# EAGLE design Quad_Board (EAGLE 7.5.0)
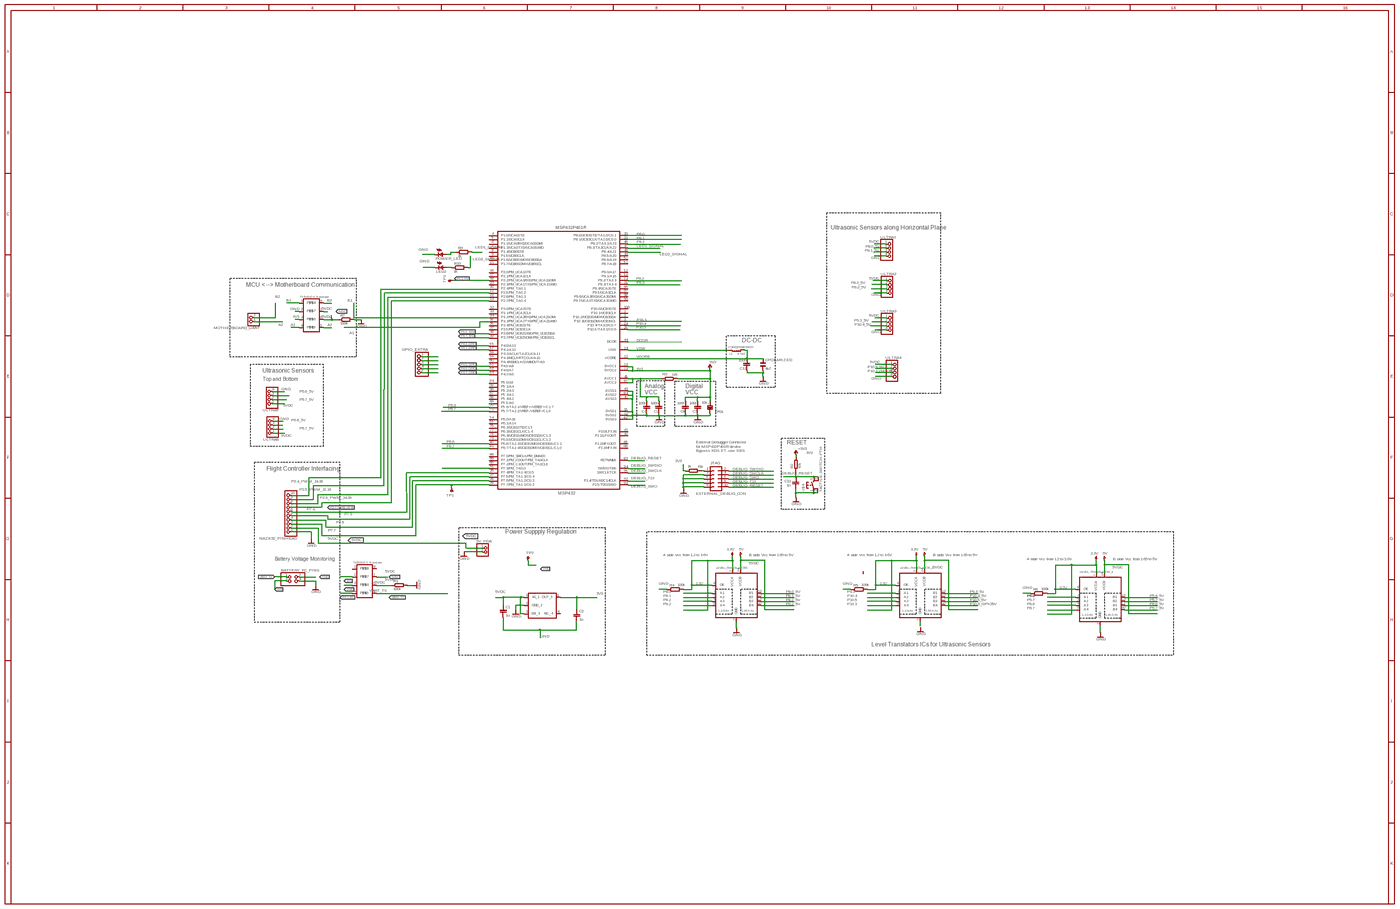
[diagram p0: schematic, sheet 1, overview]
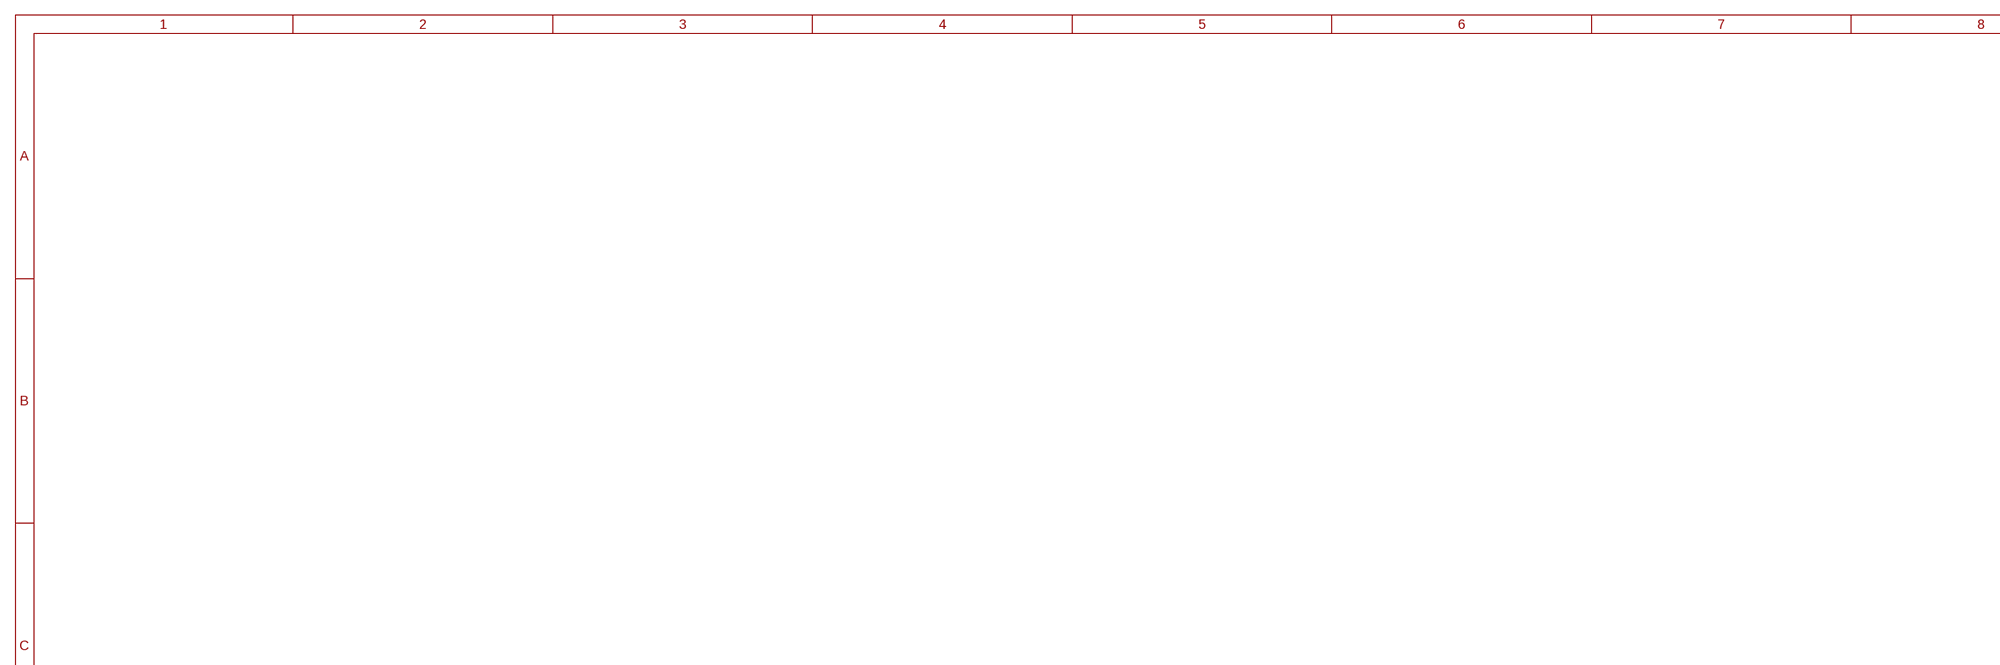
[diagram p1: schematic, sheet 1, part 1 of 4]
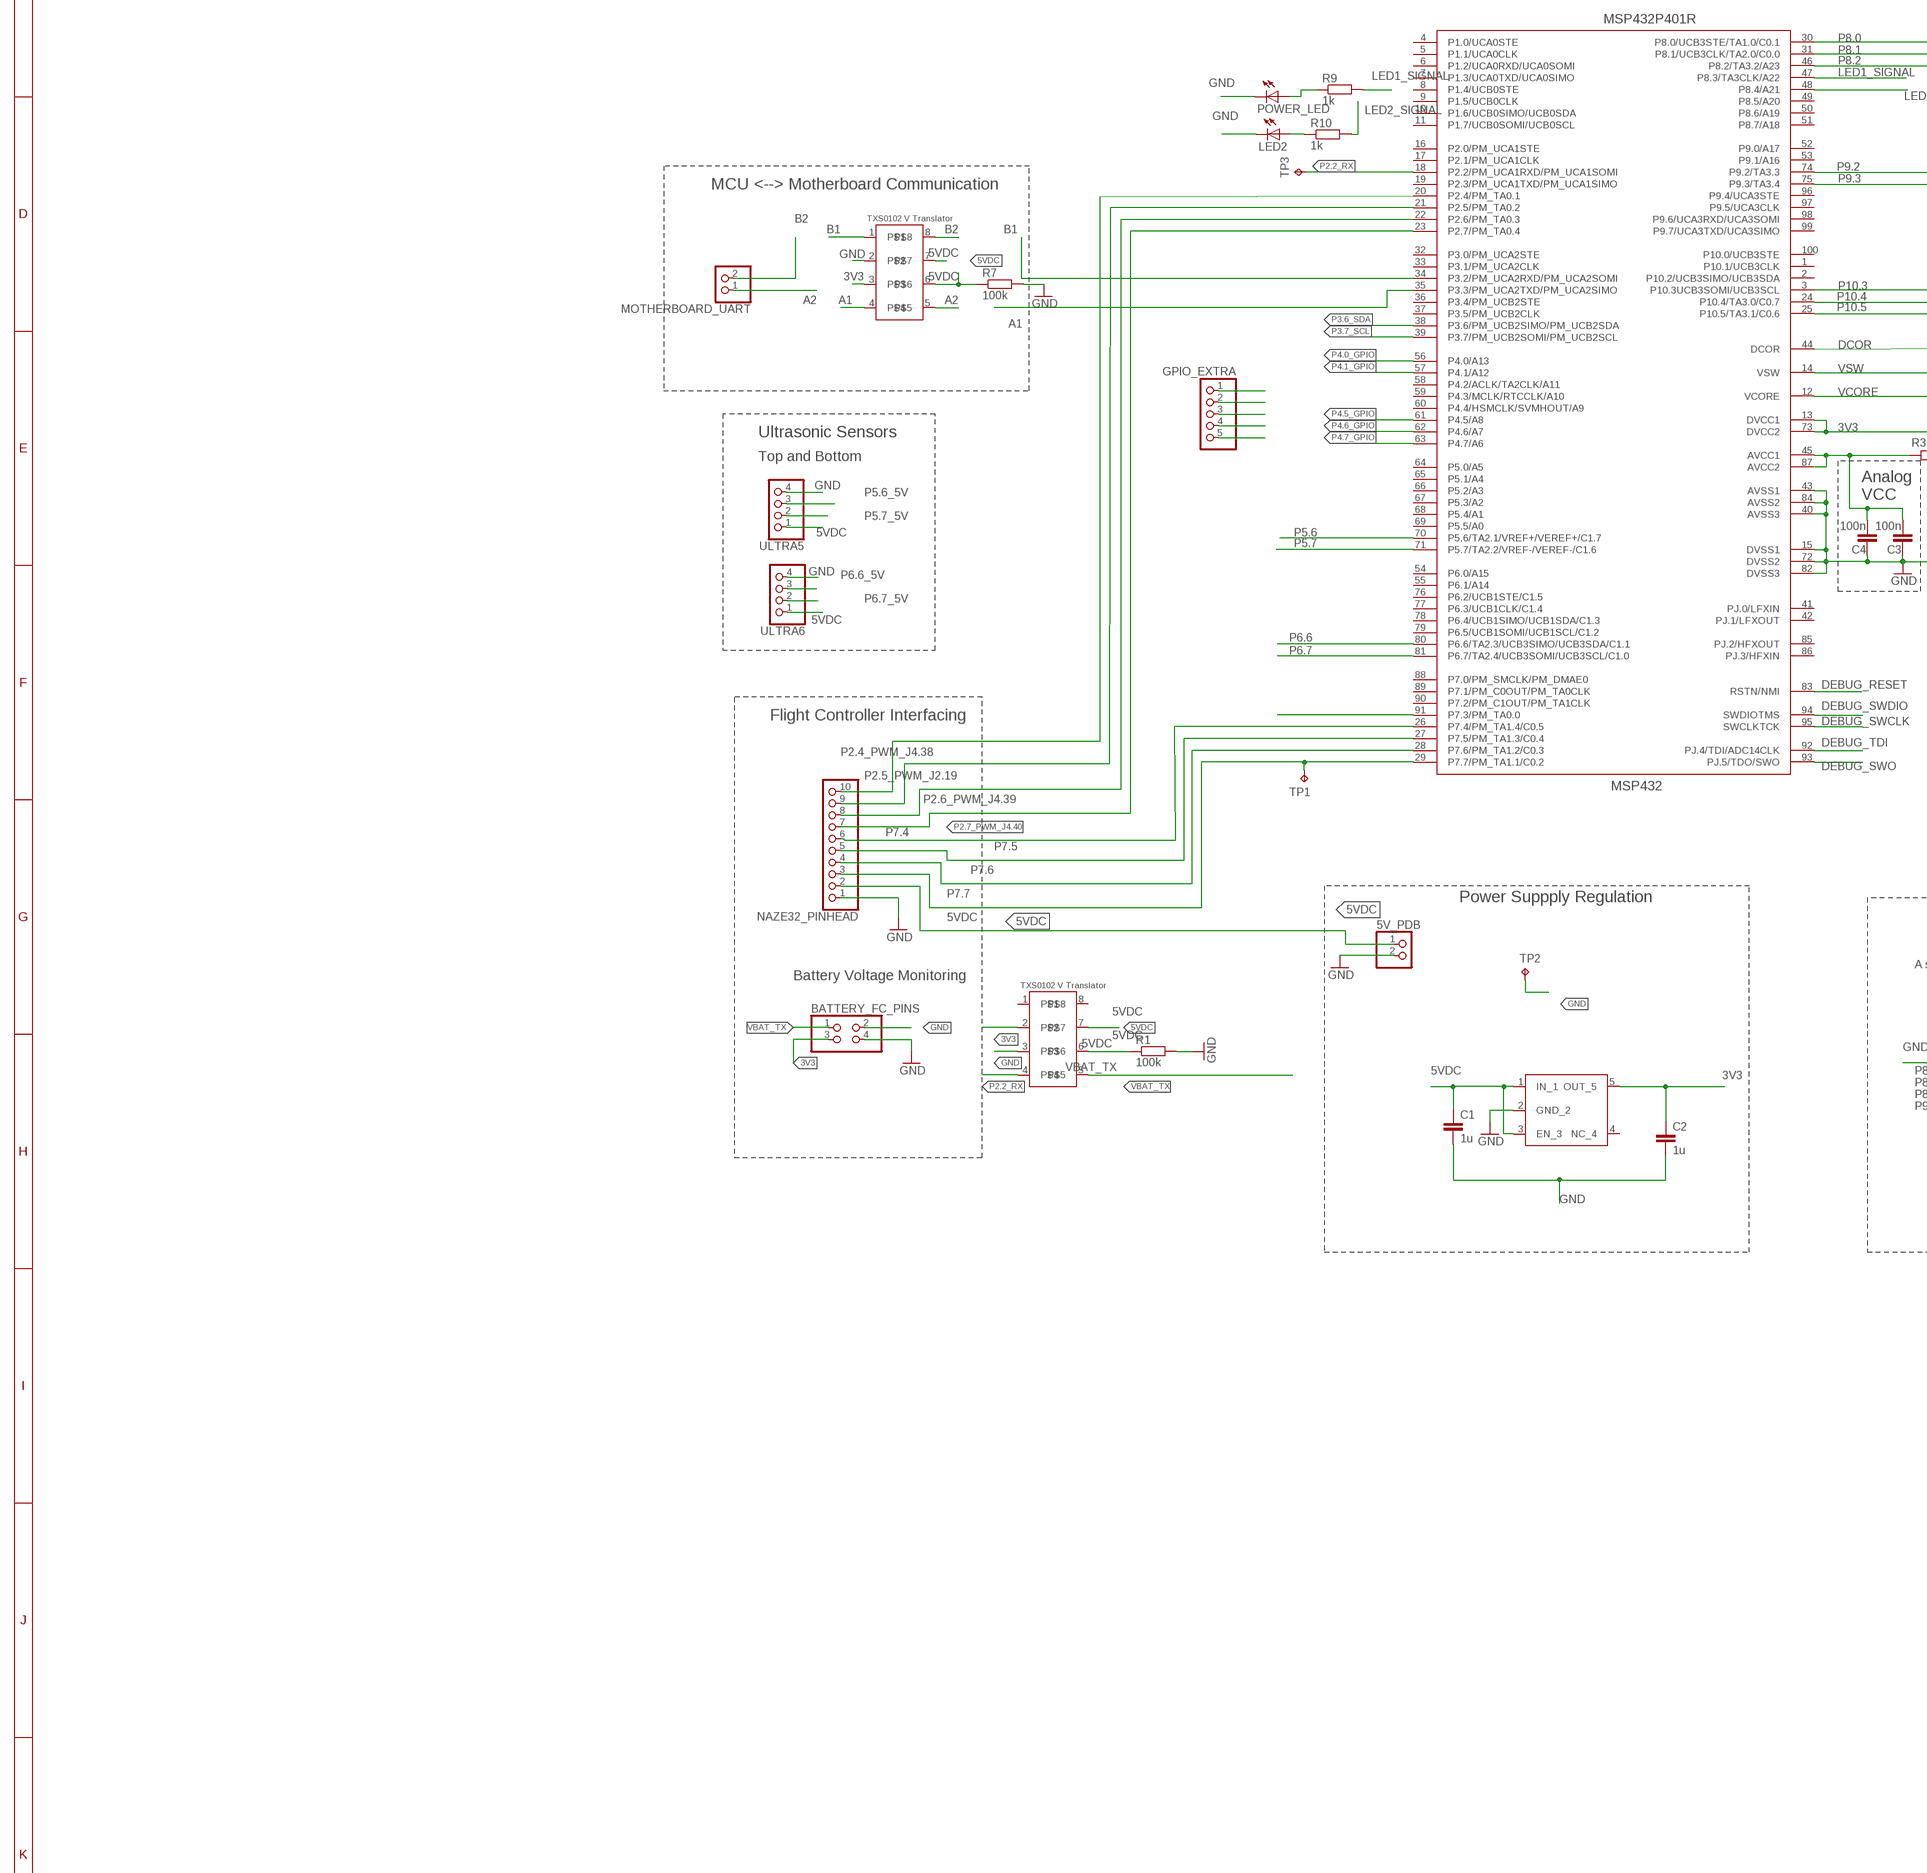
[diagram p2: schematic, sheet 1, part 2 of 4]
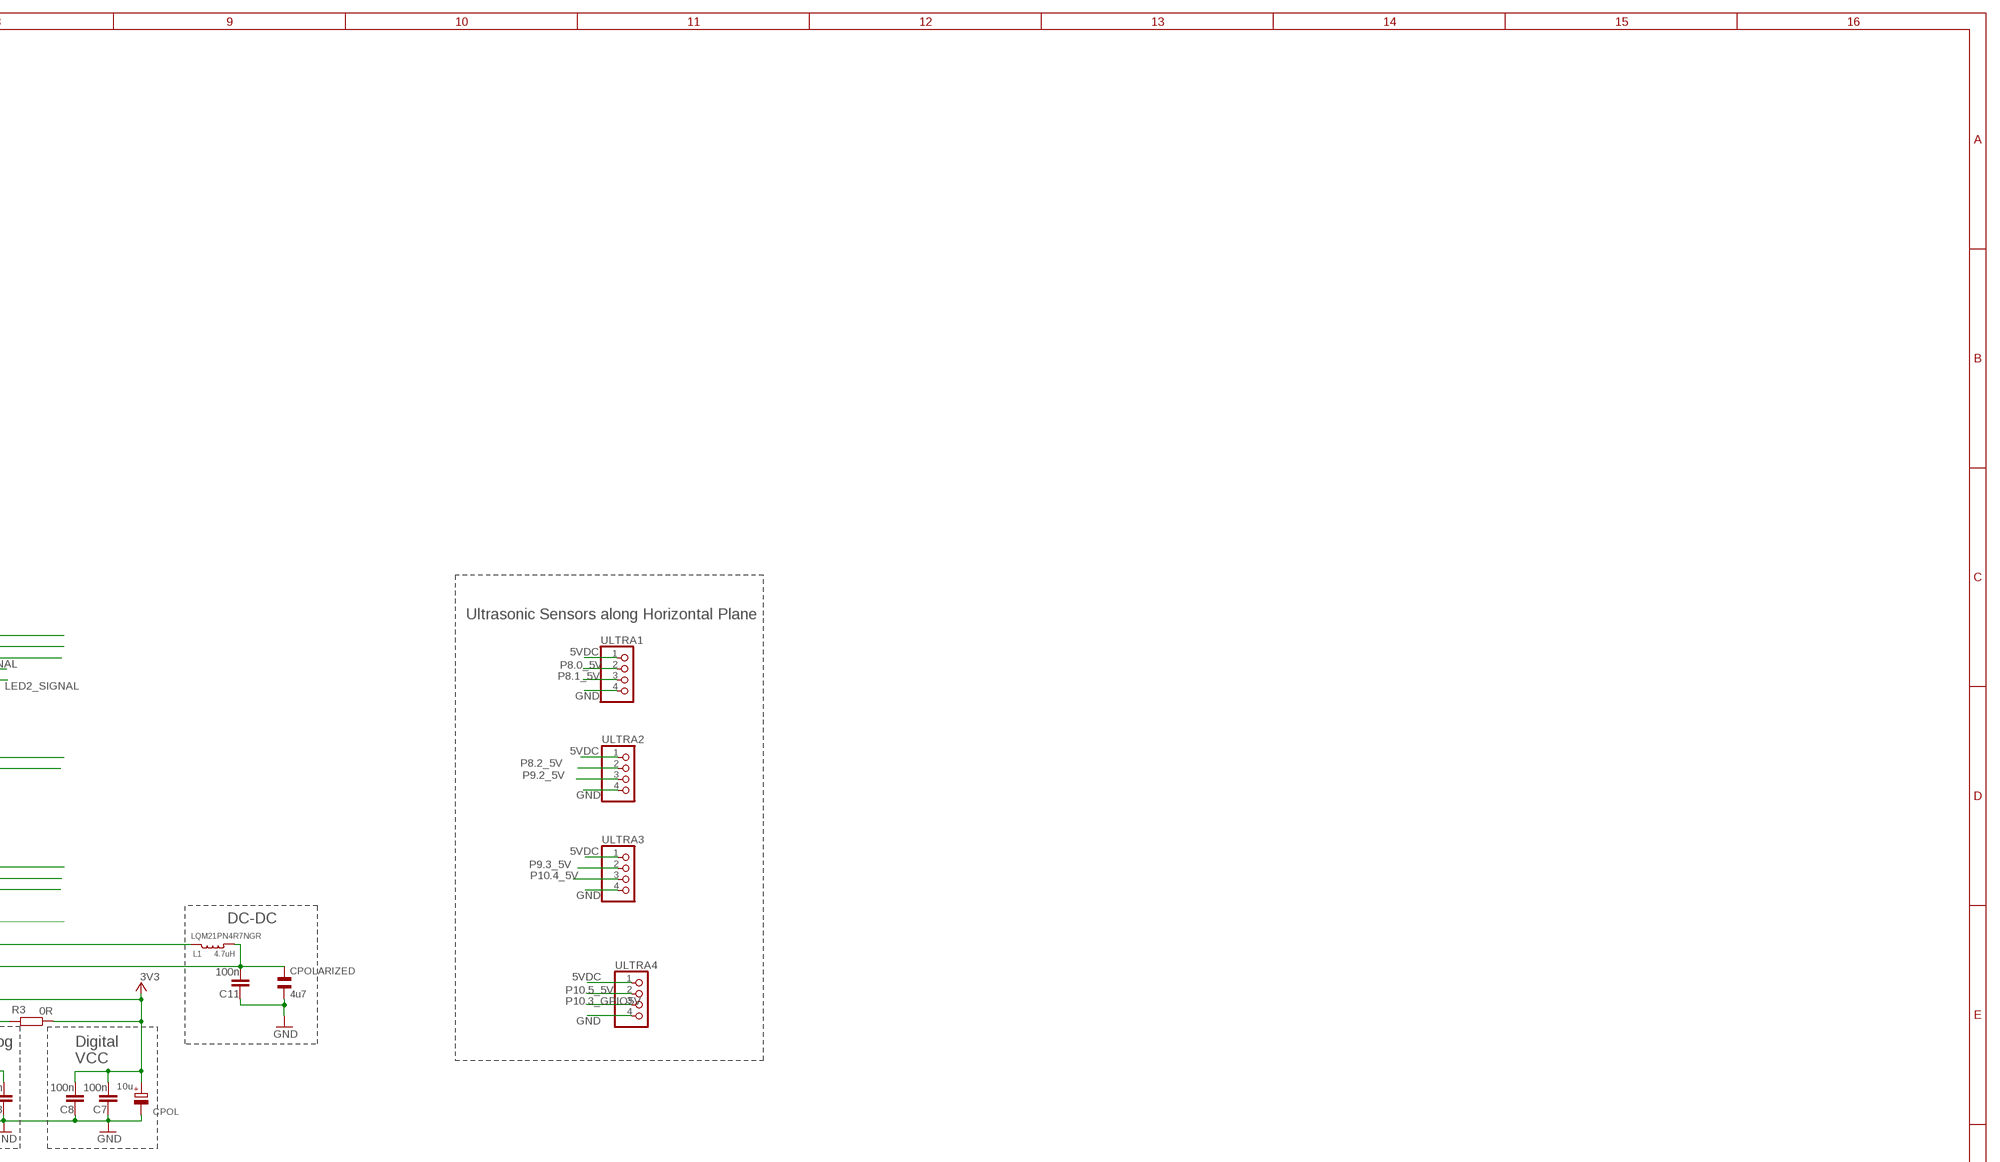
[diagram p3: schematic, sheet 1, part 3 of 4]
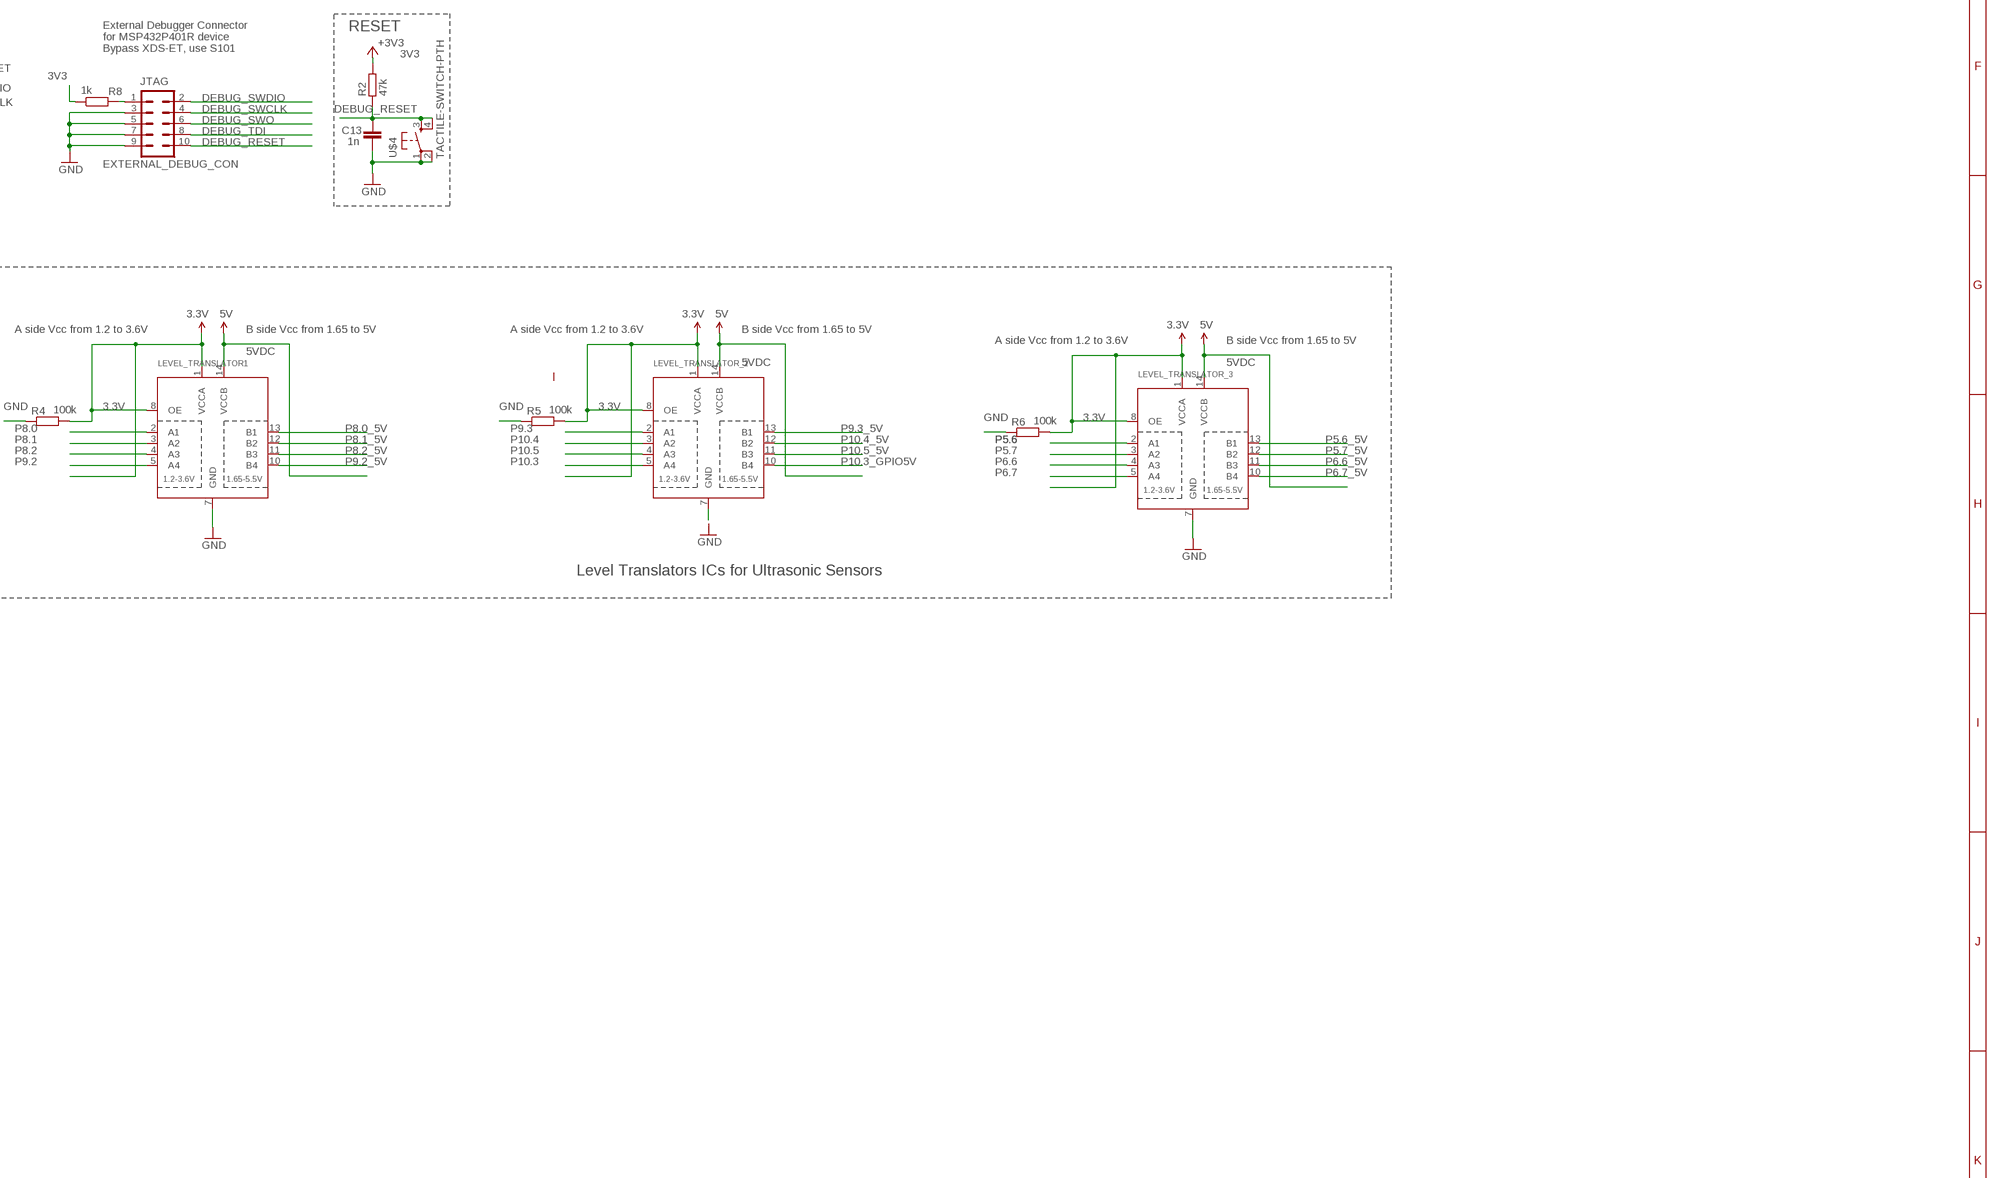
[diagram p4: schematic, sheet 1, part 4 of 4]

## Parts
5V_PDB  PINHD-1X2  [1X02]
BATTERY_FC_PINS  PINHD-2X2  [2X02]
C1  1u  C-EUC0805  [C0805]
C2  1u  C-EUC0805  [C0805]
C3  100n  C-EUC0805  [C0805]
C4  100n  C-EUC0805  [C0805]
C7  100n  C-EUC0805  [C0805]
C8  100n  C-EUC0805  [C0805]
C11  100n  C-EUC0805  [C0805]
C13  1n  C-EUC0805  [C0805]
CPOL  10u  CPOL-EUA/3216-18R  [A/3216-18R]
CPOLARIZED  4u7  CSMD0805  [CSMD0805]
GPIO_EXTRA  PINHD-1X5  [1X05]
JTAG  EXTERNAL_DEBUG_CON  [EXTERNAL_DEBUG]
L1  4.7uH  LQM2MP_G0  [0806]
LED2  LED_E  [LED_1206]
LEVEL_TRANSLATOR1  TXB0104PWRSOIC14  [SO14]
LEVEL_TRANSLATOR_2  TXB0104PWRSOIC14  [SO14]
LEVEL_TRANSLATOR_3  TXB0104PWRSOIC14  [SO14]
MOTHERBOARD_UART  PINHD-1X2  [1X02]
MSP432P401R  MSP432  [PZ100]
NAZE32_PINHEAD  PINHD-1X10  [1X10]
POWER_LED  LED_E  [LED_1206]
R1  100k  R-EU_M1206  [M1206]
R2  47k  R-EU_R1206  [R1206]
R3  0R  R-EU_RM0402  [0402]
R4  100k  R-EU_M1206  [M1206]
R5  100k  R-EU_M1206  [M1206]
R6  100k  R-EU_M1206  [M1206]
R7  100k  R-EU_M1206  [M1206]
R8  1k  R-EU_R1206  [R1206]
R9  1k  R-EU_M0805  [M0805]
R10  1k  R-EU_M0805  [M0805]
TP1  TPB1,27  [B1,27]
TP2  TPB2,54  [B2,54]
TP3  TPB1,27  [B1,27]
U$1  TXS0102  [DCT_R-PDSO-G8]
U$2  TLV733P  [SOT23-5]
U$3  TXS0102  [DCT_R-PDSO-G8]
U$4  TACTILE-SWITCH-PTH  [TAC-SWITCH-PTH]
ULTRA1  PINHD-1X4  [1X04]
ULTRA2  PINHD-1X4  [1X04]
ULTRA3  PINHD-1X4  [1X04]
ULTRA4  PINHD-1X4  [1X04]
ULTRA5  PINHD-1X4  [1X04]
ULTRA6  PINHD-1X4  [1X04]

## Nets
3.3V: LEVEL_TRANSLATOR1.1(VCCA) LEVEL_TRANSLATOR1.8(OE) LEVEL_TRANSLATOR_2.1(VCCA) LEVEL_TRANSLATOR_2.8(OE) LEVEL_TRANSLATOR_3.1(VCCA) LEVEL_TRANSLATOR_3.8(OE) R4.2 R5.2 R6.2
3V3: BATTERY_FC_PINS.3 C2.1 C7.1 C8.1 CPOL.+ MSP432P401R.13(DVCC1) MSP432P401R.73(DVCC2) R2.2 R3.1 R8.1 U$1.3 U$2.5(OUT_5) U$3.2 ; supply symbol labelled +3V3
5VDC: 5V_PDB.1 C1.1 LEVEL_TRANSLATOR1.14(VCCB) LEVEL_TRANSLATOR_2.14(VCCB) LEVEL_TRANSLATOR_3.14(VCCB) NAZE32_PINHEAD.2 R1.1 R7.1 U$1.6 U$1.7 U$2.1(IN_1) U$2.3(EN_3) U$3.6 U$3.7 ULTRA1.1 ULTRA2.1 ULTRA3.1 ULTRA4.1 ULTRA5.1 ULTRA6.1 ; supply symbol labelled 5V
A1: MSP432P401R.35(P3.3/PM_UCA2TXD/PM_UCA2SIMO) U$1.4
A2: MOTHERBOARD_UART.1 U$1.5
B1: MSP432P401R.34(P3.2/PM_UCA2RXD/PM_UCA2SOMI) U$1.1
B2: MOTHERBOARD_UART.2 U$1.8
DCOR: MSP432P401R.44(DCOR)
DEBUG_RESET: C13.1 JTAG.10 MSP432P401R.83(RSTN/NMI) R2.1 U$4.3 U$4.4
DEBUG_SWCLK: JTAG.4 MSP432P401R.95(SWCLKTCK)
DEBUG_SWDIO: JTAG.2 MSP432P401R.94(SWDIOTMS)
DEBUG_SWO: JTAG.6 MSP432P401R.93(PJ.5/TDO/SWO)
DEBUG_TDI: JTAG.8 MSP432P401R.92(PJ.4/TDI/ADC14CLK)
GND: 5V_PDB.2 BATTERY_FC_PINS.2 BATTERY_FC_PINS.4 C1.2 C2.2 C3.2 C4.2 C7.2 C8.2 C11.2 C13.2 CPOL.- CPOLARIZED.2 JTAG.3 JTAG.5 JTAG.7 JTAG.9 LED2.C LEVEL_TRANSLATOR1.7(GND) LEVEL_TRANSLATOR_2.7(GND) LEVEL_TRANSLATOR_3.7(GND) MSP432P401R.15(DVSS1) MSP432P401R.40(AVSS3) MSP432P401R.43(AVSS1) MSP432P401R.72(DVSS2) MSP432P401R.82(DVSS3) MSP432P401R.84(AVSS2) NAZE32_PINHEAD.1 POWER_LED.C R1.2 R4.1 R5.1 R6.1 R7.2 TP2.TP U$1.2 U$2.2(GND_2) U$3.3 U$4.1 U$4.2 ULTRA1.4 ULTRA2.4 ULTRA3.4 ULTRA4.4 ULTRA5.4 ULTRA6.4
LED1_SIGNAL: MSP432P401R.47(P8.3/TA3CLK/A22) R9.2
LED2_SIGNAL: MSP432P401R.48(P8.4/A21) R10.2
N$2: C3.1 C4.1 MSP432P401R.45(AVCC1) MSP432P401R.87(AVCC2) R3.2
N$5: POWER_LED.A R9.1
N$6: LED2.A R10.1
N$14: JTAG.1 R8.2
P2.2_RX: MSP432P401R.18(P2.2/PM_UCA1RXD/PM_UCA1SOMI) TP3.TP U$3.4
P2.4_PWM_J4.38: MSP432P401R.20(P2.4/PM_TA0.1) NAZE32_PINHEAD.10
P2.5_PWM_J2.19: MSP432P401R.21(P2.5/PM_TA0.2) NAZE32_PINHEAD.9
P2.6_PWM_J4.39: MSP432P401R.22(P2.6/PM_TA0.3) NAZE32_PINHEAD.8
P2.7_PWM_J4.40: MSP432P401R.23(P2.7/PM_TA0.4) NAZE32_PINHEAD.7
P3.6_SDA: MSP432P401R.38(P3.6/PM_UCB2SIMO/PM_UCB2SDA)
P3.7_SCL: MSP432P401R.39(P3.7/PM_UCB2SOMI/PM_UCB2SCL)
P4.0_GPIO: GPIO_EXTRA.1 MSP432P401R.56(P4.0/A13)
P4.1_GPIO: GPIO_EXTRA.2 MSP432P401R.57(P4.1/A12)
P4.5_GPIO: GPIO_EXTRA.3 MSP432P401R.61(P4.5/A8)
P4.6_GPIO: GPIO_EXTRA.4 MSP432P401R.62(P4.6/A7)
P4.7_GPIO: GPIO_EXTRA.5 MSP432P401R.63(P4.7/A6)
P5.6: LEVEL_TRANSLATOR_3.2(A1) MSP432P401R.70(P5.6/TA2.1/VREF+/VEREF+/C1.7)
P5.6_5V: LEVEL_TRANSLATOR_3.13(B1) ULTRA5.3
P5.7: LEVEL_TRANSLATOR_3.3(A2) MSP432P401R.71(P5.7/TA2.2/VREF-/VEREF-/C1.6)
P5.7_5V: LEVEL_TRANSLATOR_3.12(B2) ULTRA5.2
P6.6: LEVEL_TRANSLATOR_3.4(A3) MSP432P401R.80(P6.6/TA2.3/UCB3SIMO/UCB3SDA/C1.1)
P6.6_5V: LEVEL_TRANSLATOR_3.11(B3) ULTRA6.3
P6.7: LEVEL_TRANSLATOR_3.5(A4) MSP432P401R.81(P6.7/TA2.4/UCB3SOMI/UCB3SCL/C1.0)
P6.7_5V: LEVEL_TRANSLATOR_3.10(B4) ULTRA6.2
P7.3: MSP432P401R.91(P7.3/PM_TA0.0)
P7.4: MSP432P401R.26(P7.4/PM_TA1.4/C0.5) NAZE32_PINHEAD.6
P7.5: MSP432P401R.27(P7.5/PM_TA1.3/C0.4) NAZE32_PINHEAD.5
P7.6: MSP432P401R.28(P7.6/PM_TA1.2/C0.3) NAZE32_PINHEAD.4
P7.7: MSP432P401R.29(P7.7/PM_TA1.1/C0.2) NAZE32_PINHEAD.3 TP1.TP
P8.0: LEVEL_TRANSLATOR1.2(A1) MSP432P401R.30(P8.0/UCB3STE/TA1.0/C0.1)
P8.0_5V: LEVEL_TRANSLATOR1.13(B1) ULTRA1.2
P8.1: LEVEL_TRANSLATOR1.3(A2) MSP432P401R.31(P8.1/UCB3CLK/TA2.0/C0.0)
P8.1_5V: LEVEL_TRANSLATOR1.12(B2) ULTRA1.3
P8.2: LEVEL_TRANSLATOR1.4(A3) MSP432P401R.46(P8.2/TA3.2/A23)
P8.2_5V: LEVEL_TRANSLATOR1.11(B3) ULTRA2.2
P9.2: LEVEL_TRANSLATOR1.5(A4) MSP432P401R.74(P9.2/TA3.3)
P9.2_5V: LEVEL_TRANSLATOR1.10(B4) ULTRA2.3
P9.3: LEVEL_TRANSLATOR_2.2(A1) MSP432P401R.75(P9.3/TA3.4)
P9.3_5V: LEVEL_TRANSLATOR_2.13(B1) ULTRA3.2
P10.3: LEVEL_TRANSLATOR_2.5(A4) MSP432P401R.3(P10.3UCB3SOMI/UCB3SCL)
P10.3_GPIO5V: LEVEL_TRANSLATOR_2.10(B4) ULTRA4.3
P10.4: LEVEL_TRANSLATOR_2.3(A2) MSP432P401R.24(P10.4/TA3.0/C0.7)
P10.4_5V: LEVEL_TRANSLATOR_2.12(B2) ULTRA3.3
P10.5: LEVEL_TRANSLATOR_2.4(A3) MSP432P401R.25(P10.5/TA3.1/C0.6)
P10.5_5V: LEVEL_TRANSLATOR_2.11(B3) ULTRA4.2
VBAT_TX: BATTERY_FC_PINS.1 U$3.5
VCORE: C11.1 CPOLARIZED.1 L1.1 MSP432P401R.12(VCORE)
VSW: L1.2 MSP432P401R.14(VSW)
Unconnected: U$2.4(NC_4) U$3.1 U$3.8

## Notes on the sheet
- Ultrasonic Sensors along Horizontal Plane
- MCU <--> Motherboard Communication
- DC-DC
- LQM21PN4R7NGR
- Ultrasonic Sensors
- Top and Bottom
- Analog | Digital
- VCC | VCC
- RESET
- External Debugger Connector
  for MSP432P401R device
  Bypass XDS-ET, use S101
- Flight Controller Interfacing
- Power Suppply Regulation
- A side Vcc from 1.2 to 3.6V | B side Vcc from 1.65 to 5V | A side Vcc from 1.2 to 3.6V | B side Vcc from 1.65 to 5V
- Battery Voltage Monitoring | A side Vcc from 1.2 to 3.6V | B side Vcc from 1.65 to 5V
- Level Translators ICs for Ultrasonic Sensors

## Power pins joined to a net without a drawn wire
P1.0/UCA0STE: MSP432P401R.4(P1.0/UCA0STE)
P1.1/UCA0CLK: MSP432P401R.5(P1.1/UCA0CLK)
P1.2/UCA0RXD/UCA0SOMI: MSP432P401R.6(P1.2/UCA0RXD/UCA0SOMI)
P1.3/UCA0TXD/UCA0SIMO: MSP432P401R.7(P1.3/UCA0TXD/UCA0SIMO)
P1.4/UCB0STE: MSP432P401R.8(P1.4/UCB0STE)
P1.5/UCB0CLK: MSP432P401R.9(P1.5/UCB0CLK)
P1.6/UCB0SIMO/UCB0SDA: MSP432P401R.10(P1.6/UCB0SIMO/UCB0SDA)
P1.7/UCB0SOMI/UCB0SCL: MSP432P401R.11(P1.7/UCB0SOMI/UCB0SCL)
P2.0/PM_UCA1STE: MSP432P401R.16(P2.0/PM_UCA1STE)
P2.1/PM_UCA1CLK: MSP432P401R.17(P2.1/PM_UCA1CLK)
P2.3/PM_UCA1TXD/PM_UCA1SIMO: MSP432P401R.19(P2.3/PM_UCA1TXD/PM_UCA1SIMO)
P3.0/PM_UCA2STE: MSP432P401R.32(P3.0/PM_UCA2STE)
P3.1/PM_UCA2CLK: MSP432P401R.33(P3.1/PM_UCA2CLK)
P3.4/PM_UCB2STE: MSP432P401R.36(P3.4/PM_UCB2STE)
P3.5/PM_UCB2CLK: MSP432P401R.37(P3.5/PM_UCB2CLK)
P4.2/ACLK/TA2CLK/A11: MSP432P401R.58(P4.2/ACLK/TA2CLK/A11)
P4.3/MCLK/RTCCLK/A10: MSP432P401R.59(P4.3/MCLK/RTCCLK/A10)
P4.4/HSMCLK/SVMHOUT/A9: MSP432P401R.60(P4.4/HSMCLK/SVMHOUT/A9)
P5.0/A5: MSP432P401R.64(P5.0/A5)
P5.1/A4: MSP432P401R.65(P5.1/A4)
P5.2/A3: MSP432P401R.66(P5.2/A3)
P5.3/A2: MSP432P401R.67(P5.3/A2)
P5.4/A1: MSP432P401R.68(P5.4/A1)
P5.5/A0: MSP432P401R.69(P5.5/A0)
P6.0/A15: MSP432P401R.54(P6.0/A15)
P6.1/A14: MSP432P401R.55(P6.1/A14)
P6.2/UCB1STE/C1.5: MSP432P401R.76(P6.2/UCB1STE/C1.5)
P6.3/UCB1CLK/C1.4: MSP432P401R.77(P6.3/UCB1CLK/C1.4)
P6.4/UCB1SIMO/UCB1SDA/C1.3: MSP432P401R.78(P6.4/UCB1SIMO/UCB1SDA/C1.3)
P6.5/UCB1SOMI/UCB1SCL/C1.2: MSP432P401R.79(P6.5/UCB1SOMI/UCB1SCL/C1.2)
P7.0/PM_SMCLK/PM_DMAE0: MSP432P401R.88(P7.0/PM_SMCLK/PM_DMAE0)
P7.1/PM_C0OUT/PM_TA0CLK: MSP432P401R.89(P7.1/PM_C0OUT/PM_TA0CLK)
P7.2/PM_C1OUT/PM_TA1CLK: MSP432P401R.90(P7.2/PM_C1OUT/PM_TA1CLK)
P8.5/A20: MSP432P401R.49(P8.5/A20)
P8.6/A19: MSP432P401R.50(P8.6/A19)
P8.7/A18: MSP432P401R.51(P8.7/A18)
P9.0/A17: MSP432P401R.52(P9.0/A17)
P9.1/A16: MSP432P401R.53(P9.1/A16)
P9.4/UCA3STE: MSP432P401R.96(P9.4/UCA3STE)
P9.5/UCA3CLK: MSP432P401R.97(P9.5/UCA3CLK)
P9.6/UCA3RXD/UCA3SOMI: MSP432P401R.98(P9.6/UCA3RXD/UCA3SOMI)
P9.7/UCA3TXD/UCA3SIMO: MSP432P401R.99(P9.7/UCA3TXD/UCA3SIMO)
P10.0/UCB3STE: MSP432P401R.100(P10.0/UCB3STE)
P10.1/UCB3CLK: MSP432P401R.1(P10.1/UCB3CLK)
P10.2/UCB3SIMO/UCB3SDA: MSP432P401R.2(P10.2/UCB3SIMO/UCB3SDA)
PJ.0/LFXIN: MSP432P401R.41(PJ.0/LFXIN)
PJ.1/LFXOUT: MSP432P401R.42(PJ.1/LFXOUT)
PJ.2/HFXOUT: MSP432P401R.85(PJ.2/HFXOUT)
PJ.3/HFXIN: MSP432P401R.86(PJ.3/HFXIN)

## Library data of the parts
5V_PDB MOTHERBOARD_UART = pinhead:PINHD-1X2: PIN HEADER
BATTERY_FC_PINS = pinhead:PINHD-2X2: PIN HEADER
C1-C4 C7 C8 C11 C13 = rcl:C-EU: CAPACITOR, European symbol
CPOL = rcl:CPOL-EU: POLARIZED CAPACITOR, European symbol
CPOLARIZED = cap:CSMD0805
GPIO_EXTRA = pinhead:PINHD-1X5: PIN HEADER
JTAG = MSP-EXP432:EXTERNAL_DEBUG_CON
L1 = Murata:LQM2MP_G0
LED2 POWER_LED = eagle-ltspice:LED_E: LED Source: http://www.osram.convergy.de Source: www.luxeon.com Source: www.kingbright.com; SPICEMODEL: NONE; SPICEPREFIX: D; SPICETYPE: diode
LEVEL_TRANSLATOR1 LEVEL_TRANSLATOR_2 LEVEL_TRANSLATOR_3 = SparkFun-DigitalIC:TXB0104PWR: 4-Bit Bi-Directional Level Shifter 1.2V-3.6V (VCCA) to 1.65V-5.5V (VCCB) bi-directional level shifter with auto direction sensing. Max data rate - VCCA 1.8V: 20Mbps (50ns), VCCA 3.3V: 100Mbps (10ns) Digikey: 296-21929-1-ND (TSSOP) IC-11329; PROD_ID: IC-11329
MSP432P401R = MSP-EXP432:MSP432
NAZE32_PINHEAD = pinhead:PINHD-1X10: PIN HEADER
R1 R4-R7 R9 R10 = resistor:R-EU_: RESISTOR, European symbol
R2 R3 R8 = rcl:R-EU_: RESISTOR, European symbol
TP1-TP3 = testpad:TP: Test pad
U$1 U$3 = TXS0102-bi-directional-translator:TXS0102: Texas Instruments Bi-Driectional Voltage Level Translator Reference - http://www.ti.com/lit/ds/symlink/txs0102.pdf
U$2 = texas:TLV733P: Low Dropout Voltage LDO (Capacitor Free) 300mA 3.3V
U$4 = GeekAmmo:TACTILE-SWITCH: Tactile Switch 4 Pins, SPST NO
ULTRA1-ULTRA6 = pinhead:PINHD-1X4: PIN HEADER

## Net classes
0 default: width 0.254 mm

## Board
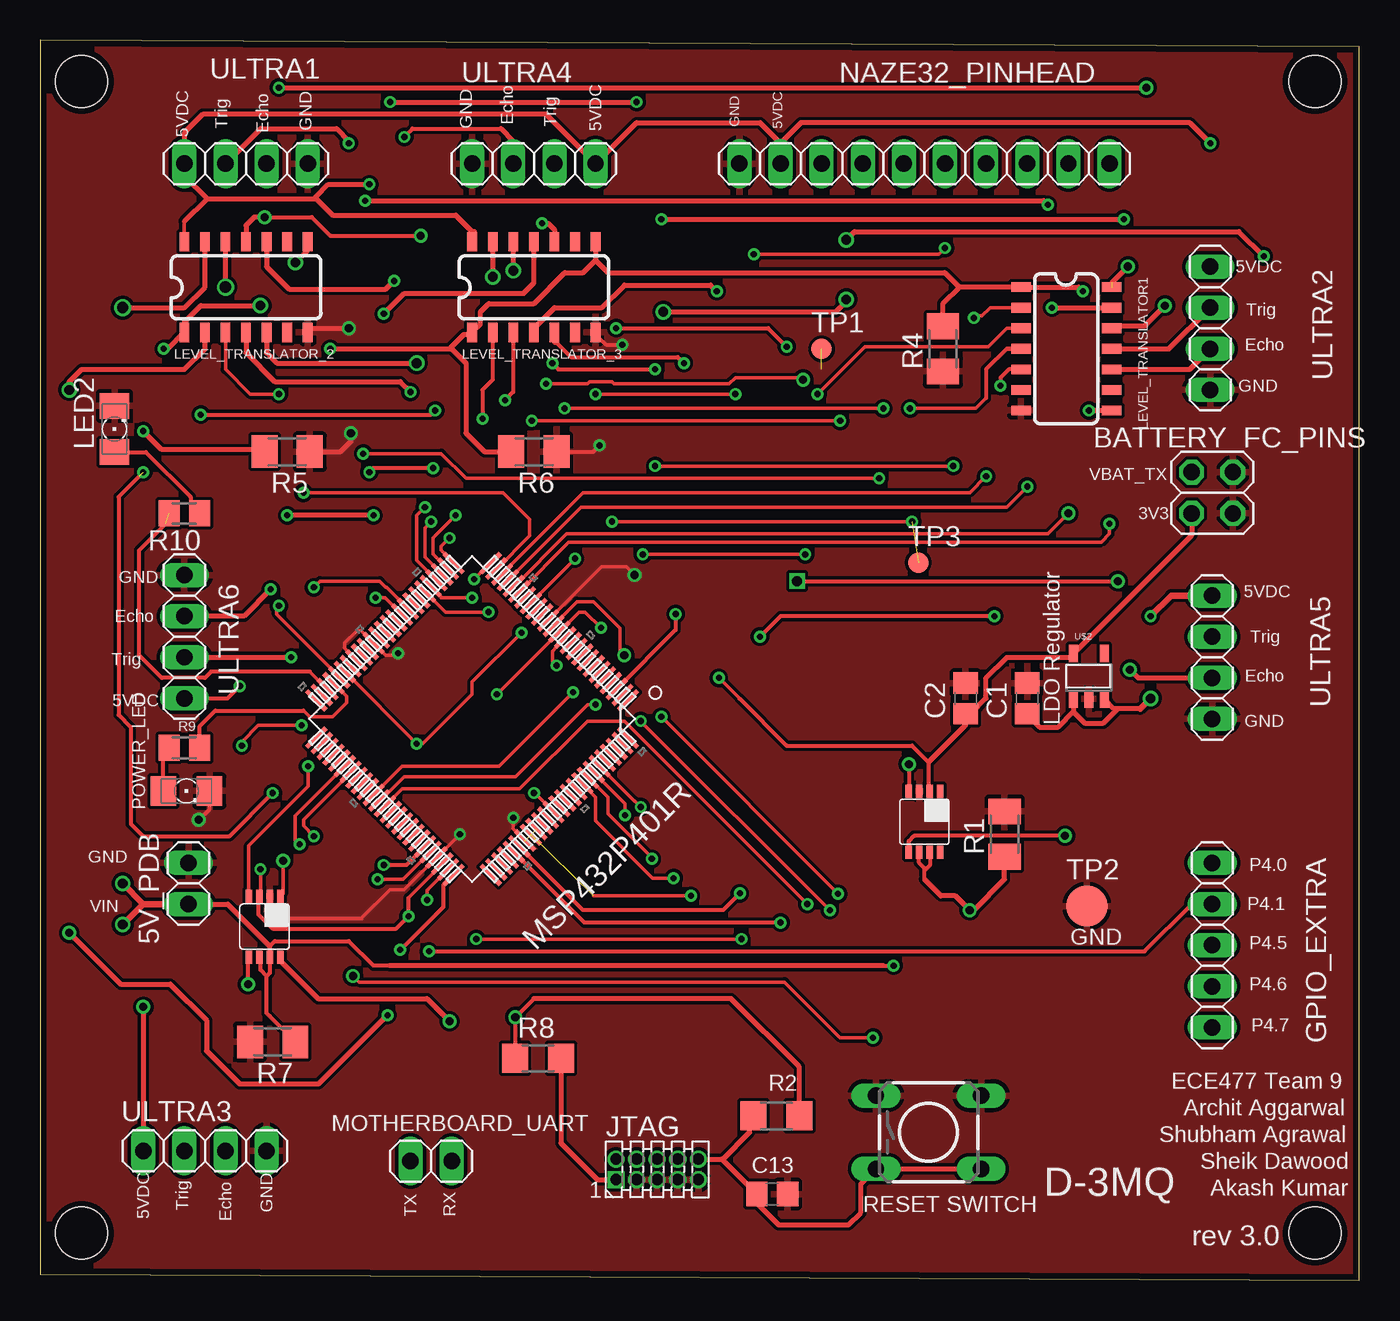
[diagram p5: board, top side]
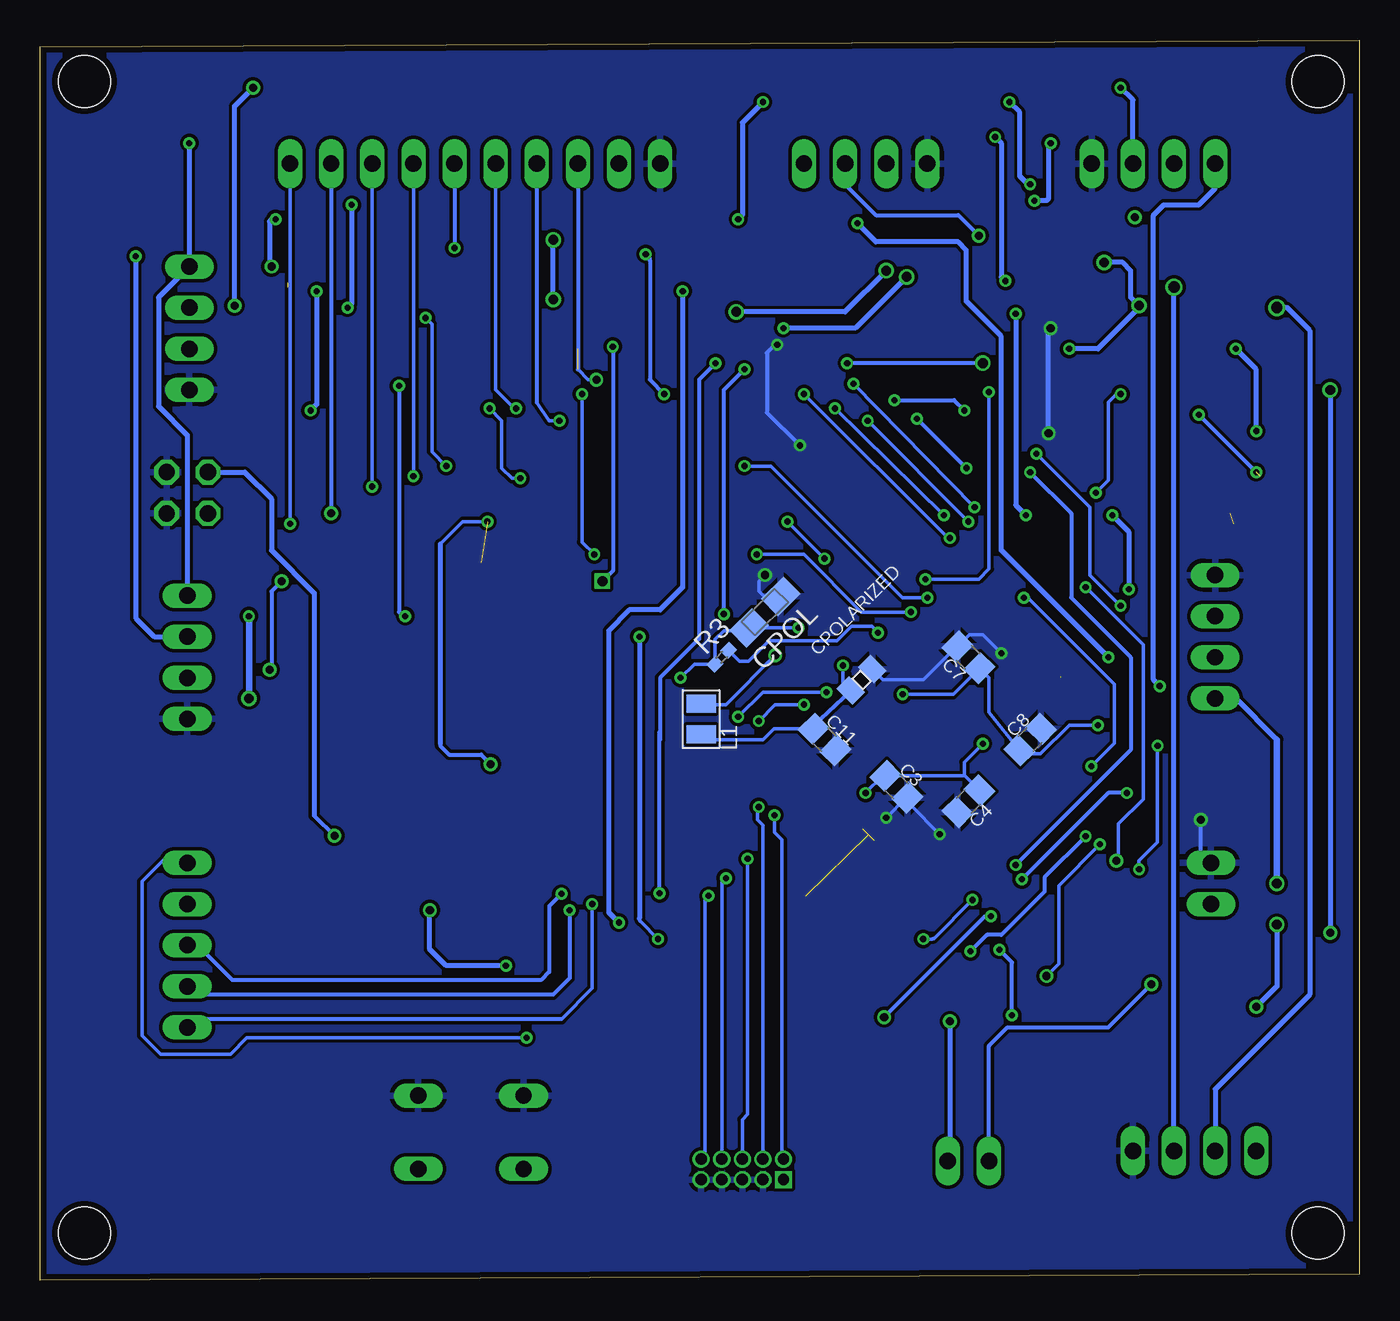
[diagram p6: board, bottom side, seen from below]

Size 81.46 x 76.57 mm. Coordinates in mm from the lower left corner, seen from the top.
Outline: 0,0.38 81.46,0 81.46,76.19 0,76.57 0,0.38
Copper layers (1*16): Top 0.0356mm / dielectric 1.5011mm / Bottom 0.0356mm
Design rules "ECE477DRC *": minimum track width 7mil, minimum drill 13mil, track to track 8mil, track to pad 8mil, pad to pad 6mil, via to via 8mil, smd to smd 6mil, copper to edge 15mil, drill to drill 8mil, minimum pad ring 7mil, minimum via ring 7mil, stop-mask expansion 3mil, vias tented up to drill 0mil, thermal gap 10mil
Holes 3.2 mm at 2.54,2.92 78.74,2.92 2.54,74.04 78.74,74.04

### Footprints (pad centres in the part's own frame; a part is rotated, then mirrored left to right if it is on the bottom)
1X02 = drill 1.016 long: 1 -1.27,0; 2 1.27,0
2X02 = drill 1.016 octagon: 1 -1.27,-1.27; 2 -1.27,1.27; 3 1.27,-1.27; 4 1.27,1.27
C0805 = smd 1.3 x 1.5: 1 -0.95,0; 2 0.95,0
A/3216-18R = smd 1.95 x 1.5: + 1.375,0; - -1.375,0
CSMD0805 = smd 1.092 x 1.397: 1 -0.94,0; 2 0.94,0
1X05 = drill 1.016 long: 1 -5.08,0; 2 -2.54,0; 3 0,0; 4 2.54,0; 5 5.08,0
EXTERNAL_DEBUG = drill 0.7 pad 0.93 square: 1 -2.54,-0.635 | drill 0.7 pad 0.93: 2 -2.54,0.635; 3 -1.27,-0.635; 4 -1.27,0.635; 5 0,-0.635; 6 0,0.635; 7 1.27,-0.635; 8 1.27,0.635; 9 2.54,-0.635; 10 2.54,0.635
0806 = smd 1.1 x 1.8: 1 -0.94,0; 2 0.94,0
LED_1206 = smd 1.6 x 1.803: A -1.422,0; C 1.422,0
SO14 = smd 0.6 x 1.2: 1 -3.81,-2.8; 2 -2.54,-2.8; 3 -1.27,-2.8; 4 0,-2.8; 5 1.27,-2.8; 6 2.54,-2.8; 7 3.81,-2.8; 8 3.81,2.8; 9 2.54,2.8; 10 1.27,2.8; 11 0,2.8; 12 -1.27,2.8; 13 -2.54,2.8; 14 -3.81,2.8
PZ100 = smd 1.676 x 0.279: 1 -7.62,5.994; 2 -7.62,5.512; 3 -7.62,5.004; 4 -7.62,4.496; 5 -7.62,3.988; 6 -7.62,3.505; 7 -7.62,2.997; 8 -7.62,2.489; 9 -7.62,2.007; 10 -7.62,1.499; 11 -7.62,0.991; 12 -7.62,0.508; 13 -7.62,0; 14 -7.62,-0.508; 15 -7.62,-0.991; 16 -7.62,-1.499; 17 -7.62,-2.007; 18 -7.62,-2.489; 19 -7.62,-2.997; 20 -7.62,-3.505; 21 -7.62,-3.988; 22 -7.62,-4.496; 23 -7.62,-5.004; 24 -7.62,-5.512; 25 -7.62,-5.994; 51 7.62,-5.994; 52 7.62,-5.512; 53 7.62,-5.004; 54 7.62,-4.496; 55 7.62,-3.988; 56 7.62,-3.505; 57 7.62,-2.997; 58 7.62,-2.489; 59 7.62,-2.007; 60 7.62,-1.499; 61 7.62,-0.991; 62 7.62,-0.508; 63 7.62,0; 64 7.62,0.508; 65 7.62,0.991; 66 7.62,1.499; 67 7.62,2.007; 68 7.62,2.489; 69 7.62,2.997; 70 7.62,3.505; 71 7.62,3.988; 72 7.62,4.496; 73 7.62,5.004; 74 7.62,5.512; 75 7.62,5.994 | smd 0.279 x 1.676: 26 -5.994,-7.62; 27 -5.512,-7.62; 28 -5.004,-7.62; 29 -4.496,-7.62; 30 -3.988,-7.62; 31 -3.505,-7.62; 32 -2.997,-7.62; 33 -2.489,-7.62; 34 -2.007,-7.62; 35 -1.499,-7.62; 36 -0.991,-7.62; 37 -0.508,-7.62; 38 0,-7.62; 39 0.508,-7.62; 40 0.991,-7.62; 41 1.499,-7.62; 42 2.007,-7.62; 43 2.489,-7.62; 44 2.997,-7.62; 45 3.505,-7.62; 46 3.988,-7.62; 47 4.496,-7.62; 48 5.004,-7.62; 49 5.512,-7.62; 50 5.994,-7.62; 76 5.994,7.62; 77 5.512,7.62; 78 5.004,7.62; 79 4.496,7.62; 80 3.988,7.62; 81 3.505,7.62; 82 2.997,7.62; 83 2.489,7.62; 84 2.007,7.62; 85 1.499,7.62; 86 0.991,7.62; 87 0.508,7.62; 88 0,7.62; 89 -0.508,7.62; 90 -0.991,7.62; 91 -1.499,7.62; 92 -2.007,7.62; 93 -2.489,7.62; 94 -2.997,7.62; 95 -3.505,7.62; 96 -3.988,7.62; 97 -4.496,7.62; 98 -5.004,7.62; 99 -5.512,7.62; 100 -5.994,7.62
1X10 = drill 1.016 long: 1 -11.43,0; 2 -8.89,0; 3 -6.35,0; 4 -3.81,0; 5 -1.27,0; 6 1.27,0; 7 3.81,0; 8 6.35,0; 9 8.89,0; 10 11.43,0
M1206 = smd 1.6 x 2: 1 -1.4,0; 2 1.4,0
R1206 = smd 1.6 x 1.803: 1 -1.422,0; 2 1.422,0
0402 = smd 0.8 x 0.7: 1 -0.6,0; 2 0.6,0
M0805 = smd 1.3 x 1.6: 1 -0.95,0; 2 0.95,0
B1,27 = smd 1.27 x 1.27: TP 0,0
B2,54 = smd 2.54 x 2.54: TP 0,0
DCT_R-PDSO-G8 = smd 0.4 x 0.8: 1 -0.975,-1.875; 2 -0.325,-1.875; 3 0.325,-1.875; 4 0.975,-1.875; 5 0.975,1.875; 6 0.325,1.875; 7 -0.325,1.875; 8 -0.975,1.875
SOT23-5 = smd 0.55 x 1.1: 1 -0.95,-1.3; 2 0,-1.3; 3 0.95,-1.3; 4 0.95,1.5; 5 -0.95,1.5
TAC-SWITCH-PTH = drill 1.016 pad 1.524 long: 1 -3.251,2.261; 2 3.251,2.261; 3 -3.251,-2.261; 4 3.251,-2.261
1X04 = drill 1.016 long: 1 -3.81,0; 2 -1.27,0; 3 1.27,0; 4 3.81,0

### Placement (x,y rotation side)
5V_PDB  9.14,24.51 90 top
BATTERY_FC_PINS  72.39,48.64 270 top
C1  60.96,35.94 90 top
C2  57.15,35.94 90 top
C3  28.57,30.48 315 bottom
C4  24.13,29.59 225 bottom
C7  24.13,38.48 135 bottom
C8  20.32,33.4 45 bottom
C11  33.02,33.4 315 bottom
C13  45.21,5.33 0 top
CPOL  36.7,41.27 225 bottom
CPOLARIZED  30.73,37.08 45 bottom
GPIO_EXTRA  72.39,20.7 270 top
JTAG  38.1,6.86 0 top
L1  40.64,34.67 90 bottom
LED2  4.57,52.58 90 top
LEVEL_TRANSLATOR1  63.37,57.53 270 top
LEVEL_TRANSLATOR_2  12.7,61.34 0 top
LEVEL_TRANSLATOR_3  30.48,61.34 0 top
MOTHERBOARD_UART  24.13,7.37 0 top
MSP432P401R  26.67,34.67 225 top
NAZE32_PINHEAD  54.61,68.96 0 top
POWER_LED  9.02,30.23 0 top
R1  59.56,27.56 90 top
R2  45.47,10.16 0 top
R3  39.37,38.48 45 bottom
R4  55.75,57.53 90 top
R5  15.24,51.18 180 top
R6  30.48,51.18 180 top
R7  14.35,14.73 180 top
R8  30.73,13.72 0 top
R9  8.89,32.89 0 top
R10  8.89,47.37 180 top
TP1  48.26,57.53 0 top
TP2  64.64,23.11 0 top
TP3  54.23,44.32 0 top
U$1  13.84,21.84 180 top
U$2  64.77,37.21 0 top
U$3  54.61,28.32 180 top
U$4  54.86,9.14 0 top
ULTRA1  12.7,68.96 0 top
ULTRA2  72.26,58.8 270 top
ULTRA3  10.16,8 0 top
ULTRA4  30.48,68.96 180 top
ULTRA5  72.39,38.48 270 top
ULTRA6  8.89,39.75 90 top

### Tracks (layer width: path | path; a pad name or v marks a point on that pad's centre or on a via)
3.3V  (via drill 0.38, 0.6)
  Top 0.203: 16.51,63.63 LEVEL_TRANSLATOR_2.8
  Top 0.254: 13.97,51.31 R5.2
  Top 0.305: v13.59,60.2 9.91,60.2 8.89,59.18 LEVEL_TRANSLATOR_2.1 7.88,57.53 v7.62,57.53 | v15.75,62.87 16.51,63.63 | 56.76,61.34 LEVEL_TRANSLATOR1.1 64.14,61.34 v64.39,61.09 | v17.91,57.53 25.27,57.53 | 34.29,62.99 33.53,62.23 32.38,62.23 30.48,60.33 27.69,60.33 27.18,59.82 27.18,59.05 LEVEL_TRANSLATOR_3.1 26.55,58.42 26.16,58.42 25.27,57.53 | 34.29,62.99 35.05,62.23 55.87,62.23 56.76,61.34 | v64.77,53.72 LEVEL_TRANSLATOR1.8 | R4.2 55.75,60.33 56.76,61.34 | 13.97,51.31 7.49,51.31 v6.35,52.45 | 25.27,57.53 25.4,57.53 26.29,56.64 26.29,52.32 27.43,51.18 R6.2 | LEVEL_TRANSLATOR_3.8 34.29,62.99
  Bottom 0.305: v15.75,62.87 14.61,62.87 14.1,62.36 14.1,60.71 v13.59,60.2 13.59,60.07 16.13,57.53 v17.91,57.53 | v64.39,61.09 64.39,54.1 v64.77,53.72 | v6.35,52.45 6.35,56.26 v7.62,57.53
3V3  (via drill 0.38, 0.5)
  Top 0.203: v41.91,37.21 43.18,35.94 | v34.63,40.3 33.66,41.27 33.27,41.27 MSP432P401R.13 v28.19,36.2 | v12.45,33.02 12.45,33.27 13.46,34.29 v16.13,34.29 | 13.46,23.11 13.46,23.66 U$1.3 13.59,23.79 v13.59,25.4 | 22.73,23.62 24.82,25.71 MSP432P401R.73
  Top 0.254: 43.18,35.94 46.1,33.02 53.85,33.02 54.86,32 54.86,30.27 U$3.2 | 13.46,23.11 13.46,22.61 14.35,21.72 21.97,21.72 v22.73,22.48 22.73,23.62 | R8.1 29.34,13.74 v29.34,16.26 30.48,17.4
  Top 0.305: BATTERY_FC_PINS.3 71.12,46.01 U$2.5 63.59,38.48 59.69,38.48 58.42,37.21 58.42,35.94 57.47,34.99 C2.1 57.15,34.29 54.86,32 | R2.2 46.89,13.18 42.67,17.4 30.48,17.4
  Bottom 0.203: v16.13,34.29 17.91,34.29 19.68,32.51 20.28,32.51 C8.1 22.86,35.09 22.86,37.21 C7.1 | v41.91,37.21 41.06,38.06 R3.1 39.79,39.58 39.24,40.13 37.85,40.13 CPOL.+ v34.63,40.3 | C7.1 23.68,37.59 | v28.19,36.2 25.07,36.2 C7.1 | v12.45,33.02 12.45,27.05 13.59,25.91 v13.59,25.4
  Bottom 0.254: v29.34,16.26 23.11,22.48 v22.73,22.48
5VDC  (via drill 0.38, 0.5, 0.6)  (1 unrouted)
  Top 0.203: 8.89,65.41 LEVEL_TRANSLATOR_2.14
  Top 0.254: ULTRA6.1 11.56,35.94 v12.32,36.7 | R7.1 14.17,16.31 14.16,16.31 13.97,16.51 13.97,18.8 | 13.97,18.8 13.59,19.18 13.59,19.9 U$1.6 | 13.97,18.8 14.17,18.99 U$1.7 14.17,20.64 14.48,20.96 19.05,20.96 20.57,19.43 21.59,19.43 | 52.07,19.43 v52.7,19.43 | 8.76,64.01 LEVEL_TRANSLATOR_2.14 | 54.61,24.77 54.61,25.3 | 54.61,25.3 54.61,25.45 54.28,25.78 U$3.6 | 54.61,25.3 54.94,25.62 U$3.7
  Top 0.305: 45.72,70.23 44.45,71.5 36.83,71.5 ULTRA4.1 31.24,72.01 10.03,72.01 8.89,70.87 ULTRA1.1 8.89,68.2 10.29,66.8 | 45.72,70.23 NAZE32_PINHEAD.2 | 45.72,70.23 46.99,71.5 70.99,71.5 v72.26,70.23 | v6.35,16.89 ULTRA3.1 | 67.94,35.31 66.55,35.31 | 66.55,35.31 66.33,35.31 U$2.3 | U$2.1 63.82,35.11 | 63.82,35.11 64.52,34.42 65.66,34.42 66.55,35.31 | 52.07,19.43 21.59,19.43 | 26.67,64.77 LEVEL_TRANSLATOR_3.14 | 26.8,64.77 26.67,64.77 | 8.89,65.41 10.29,66.8 | 26.67,64.77 25.65,65.79 18.03,65.79 17.02,66.8 | 10.29,66.8 17.02,66.8 | v67.18,62.61 66.17,61.6 | 17.02,66.8 17.02,66.93 17.78,67.69 v20.32,67.69 | v21.59,72.77 v36.83,72.77 | v38.35,65.53 v66.93,65.53 | 54.61,24.77 55.63,23.75 56.52,23.75 v57.4,22.86 57.66,22.86 59.56,24.77 R1.1 | C1.1 60.96,34.92 61.72,34.16 62.87,34.16 63.82,35.11 | 5V_PDB.1 11.57,23.24 14.17,20.64
  Top 0.406: 5V_PDB.1 6.35,23.24 | 6.35,23.24 v5.08,24.51 | v5.08,21.97 6.35,23.24 | ULTRA5.1 69.85,42.29 v68.58,41.02 | 67.94,35.31 v68.58,35.94
  Bottom 0.305: 5.08,33.4 7.62,35.94 ULTRA6.1 | ULTRA1.1 8.89,67.44 9.91,66.42 12.06,66.42 12.7,65.79 12.7,37.08 v12.32,36.7 | v72.26,70.23 ULTRA2.1 74.17,60.71 74.17,53.98 72.39,52.2 ULTRA5.1 | v5.08,21.97 5.08,18.16 v6.35,16.89 | v20.32,67.69 20.45,67.69 20.95,68.2 20.95,72.14 v21.59,72.77 | v36.83,72.77 38.1,71.5 38.1,65.79 v38.35,65.53 | v66.93,65.53 67.18,65.53 67.31,65.41 67.31,62.74 v67.18,62.61 | v52.7,19.43 56.39,19.43 57.4,20.45 v57.4,22.86
  Bottom 0.406: v5.08,24.51 5.08,33.4 | v68.58,41.02 v68.58,35.94
A1  (via drill 0.38)
  Top 0.203: v20.7,42.16 21.3,42.16 MSP432P401R.35 | U$1.4 12.87,26.84 16.54,30.5 v16.54,31.75
  Bottom 0.203: v20.7,42.16 20.53,42.16 arc45 20.39,42.1 15.11,36.83 15.11,33.17 v16.54,31.75
A2  (via drill 0.5)
  Top 0.254: v12.83,18.29 12.83,19.93 U$1.5
  Bottom 0.254: MOTHERBOARD_UART.1 22.86,14.48 21.72,15.62 15.49,15.62 v12.83,18.29
B1  (via drill 0.38, 0.5)
  Top 0.203: MSP432P401R.34 21.38,42.8 21.34,42.8 20.95,43.18 17.27,43.18 v16.89,42.8 | v14.99,25.91 14.99,23.89 U$1.1
  Bottom 0.203: v16.89,42.8 13.34,39.24 13.34,29.72 14.86,28.19 14.86,26.04 v14.99,25.91
B2  (via drill 0.5)
  Top 0.254: U$1.8 14.82,19.73
  Top 0.305: 14.82,19.73 17.14,17.4 23.88,17.4 v25.27,16
  Bottom 0.305: v25.27,16 25.27,7.49 MOTHERBOARD_UART.2
DEBUG_RESET  (via drill 0.38)  (1 unrouted)
  Top 0.203: 34.16,23.75 v40.18,23.75
  Top 0.305: JTAG.10 42.1,7.49 | U$4.4 U$4.3 50.67,5.94 50.67,4.19 49.91,3.43 45.59,3.43 44.26,4.76 C13.1 42.1,7.49 | 42.1,7.49 42.16,7.49 43.81,9.14 43.81,9.93 R2.1
  Bottom 0.203: v40.18,23.75 40.41,23.52 40.41,7.72 JTAG.10
DEBUG_SWCLK  (via drill 0.38)
  Top 0.203: MSP432P401R.95 36.7,29.59 36.73,29.59 v37.08,29.23
  Bottom 0.203: JTAG.4 36.83,28.12 37.16,28.45 37.16,29.16 v37.08,29.23
DEBUG_SWDIO  (via drill 0.38)
  Top 0.203: MSP432P401R.94 34.18,31.36 35.05,30.48 35.08,30.48 36.12,29.44 v36.12,28.73
  Bottom 0.203: v36.12,28.73 36.12,27.69 35.64,27.2 35.64,7.57 JTAG.2
DEBUG_SWO  (via drill 0.38)
  Top 0.203: MSP432P401R.93 33.85,31.04 35.05,29.84 35.05,28.83 37.77,26.11 v37.77,26.04
  Bottom 0.203: v37.77,26.04 37.77,10.26 38.1,9.93 JTAG.6
DEBUG_TDI  (via drill 0.38)
  Top 0.203: MSP432P401R.92 33.48,30.66 34.29,29.84 34.29,28.37 37.82,24.84 v39.12,24.84
  Bottom 0.203: JTAG.8 39.37,24.59 v39.12,24.84
GND  (via drill 0.38, 0.5)  (1 unrouted)
  Top 0.203: MSP432P401R.43 18.8,39.02 18.8,39.37 19.56,40.13 19.81,40.13 MSP432P401R.40 21.34,38.61 21.97,38.61 v22.1,38.73 | MSP432P401R.82 29.21,27.89 v29.21,28.57 | v25.91,27.56 24.46,26.11 MSP432P401R.72 22.48,24.13 21.59,24.13 19.81,22.35 | MSP432P401R.15 34.67,44.07 36.2,44.07 v36.7,43.56
  Top 0.254: LEVEL_TRANSLATOR_3.7 34.42,58.54 34.42,58.29 34.92,57.79 v35.94,57.79 | MSP432P401R.15 | R6.1 34.16,51.18 v34.54,51.56 | v9.78,28.45 10.44,29.11 POWER_LED.C | U$1.2 14.22,23.66 14.22,22.86 14.73,22.35 19.81,22.35
  Top 0.305: LEVEL_TRANSLATOR_2.7 16.77,58.8 v19.05,58.8 | R5.1 18.54,51.18 19.18,51.82 v19.18,52.32
  Bottom 0.203: v29.21,28.57 27.98,29.81 C3.2 27.69,29.59 27.69,29.34 v25.91,27.56 | v22.1,38.73 23.24,39.88 24.08,39.88 C7.2 24.86,39.15 26.92,37.08 29.41,37.08 CPOLARIZED.2 | v36.7,43.56 37.08,43.18 37.08,42.55 36.32,41.78 36.2,41.78 CPOL.-
  Bottom 0.254: v34.54,51.56 36.58,53.59 36.58,57.28 36.07,57.79 v35.94,57.79 | 5V_PDB.2 9.78,26.42 v9.78,28.45
  Bottom 0.305: v19.18,52.32 19.18,58.67 v19.05,58.8
  pour Bottom: 0,76.58 0,0.38 81.28,0.38 81.28,76.58
  pour Top: 0,76.58 0,0.38 81.28,0.38 81.28,76.58
LED1_SIGNAL
  Top 0.203: MSP432P401R.47 18.92,36.06 18.92,35.69 18.03,34.8 16.64,34.8 16.26,35.18
  Top 0.254: R9.2 9.84,34.22 10.79,35.18 16.26,35.18
LED2_SIGNAL  (1 unrouted)
  Top 0.203: 16.64,37.59 17.71,36.52 MSP432P401R.48
  Top 0.254: 16.64,37.59 10.54,37.59 10.16,37.21 7.49,37.21 6.1,38.61 6.1,45.09 7.75,46.74
N$2  (via drill 0.38)
  Top 0.203: MSP432P401R.45 v23.24,33.15 23.62,33.15 26.67,36.2 26.67,36.96 v29.72,40.01 | v30.48,30.1 30.52,30.1 MSP432P401R.87
  Bottom 0.203: v30.48,30.1 29.43,31.15 C3.1 24.42,31.15 24.38,31.19 | v23.24,33.15 24.38,32 24.38,31.19 | 24.38,31.19 C4.1 | v29.72,40.01 30.1,40.39 31.37,40.39 32.26,39.5 36.45,39.5 37.72,38.23 38.27,38.23 R3.2
N$5
  Top 0.254: POWER_LED.A 7.59,32.55 R9.1
N$6
  Top 0.254: LED2.A 6.5,51.16 9.27,48.39 9.27,47.94 R10.1
N$14
  Top 0.305: R8.2 32.16,8.48 34.42,6.22 JTAG.1
P2.2_RX  (via drill 0.38, 0.5)  (1 unrouted)
  Top 0.203: MSP432P401R.18 30.3,41.85 v33.02,44.58 | v35.31,46.86 v53.85,46.86
  Top 0.254: v53.65,31.88 53.65,30.21 U$3.4
  Bottom 0.203: v33.02,44.58 v35.31,46.86 | v53.85,46.86 55.37,46.86 56.77,45.47
  Bottom 0.254: 56.77,33.15 56.77,33.02 56.21,32.46 54.23,32.46 v53.65,31.88
  Bottom 0.305: 56.77,45.47 56.77,33.15
P2.4_PWM_J4.38  (via drill 0.38)
  Top 0.203: MSP432P401R.20 32.64,45.59 65.53,45.59 66.04,46.1 v66.04,46.74
  Bottom 0.203: v66.04,46.74 NAZE32_PINHEAD.10
P2.5_PWM_J2.19  (via drill 0.5)
  Top 0.203: MSP432P401R.21 29.29,42.88 32.51,46.1 62.23,46.1 v63.5,47.37
  Bottom 0.254: NAZE32_PINHEAD.9 v63.5,47.37
P2.6_PWM_J4.39  (via drill 0.38)
  Top 0.203: MSP432P401R.22 33.4,47.75 59.69,47.75 v60.96,49.02
  Bottom 0.203: v60.96,49.02 NAZE32_PINHEAD.8
P2.7_PWM_J4.40  (via drill 0.38)
  Top 0.203: v58.42,49.66 57.4,48.64 33.53,48.64 28.52,43.63 MSP432P401R.23
  Bottom 0.203: NAZE32_PINHEAD.7 v58.42,49.66
P4.0_GPIO  (via drill 0.38, 0.5)
  Top 0.203: MSP432P401R.56 15.75,28.7 15.75,27.18 v16,26.92 | v19.3,18.8 19.68,18.41 45.97,18.41 49.4,14.99 v51.44,14.99
  Bottom 0.203: v16,26.92 18.54,24.38 18.54,19.56 v19.3,18.8 | v51.44,14.99 68.71,14.99 69.72,13.97 74.04,13.97 75.18,15.11 75.18,24.64 73.79,26.04 72.64,26.04 GPIO_EXTRA.1
P4.1_GPIO  (via drill 0.38)
  Top 0.203: MSP432P401R.57 19.21,31.4 16.26,28.45 16.26,28.07 v16.89,27.43
  Top 0.254: v24,20.32 68.2,20.32 71.12,23.24 GPIO_EXTRA.2
  Bottom 0.254: v16.89,27.43 19.43,24.89 19.43,24 22.1,21.34 22.99,21.34 v24,20.32
P4.5_GPIO  (via drill 0.38)
  Top 0.203: MSP432P401R.61 22.35,31.75 28.32,31.75 v32.89,36.32 | v38.35,34.8 v49.28,23.88
  Bottom 0.203: v38.35,34.8 36.83,36.32 v32.89,36.32
  Bottom 0.254: v49.28,23.88 50.04,23.11 50.04,19.05 50.55,18.54 69.6,18.54 71.75,20.7 GPIO_EXTRA.3
P4.6_GPIO  (via drill 0.38)
  Top 0.203: MSP432P401R.62 20.92,29.69 21.05,29.69 22.48,31.12 29.34,31.12 33.78,35.56 v34.29,35.56 | v37.08,34.54 v48.77,22.86
  Bottom 0.203: v37.08,34.54 36.07,35.56 v34.29,35.56
  Bottom 0.254: v48.77,22.86 48.77,18.67 49.78,17.65 71.88,17.65 GPIO_EXTRA.4
P4.7_GPIO  (via drill 0.38)
  Top 0.203: MSP432P401R.63 22.35,30.35 29.59,30.35 33.78,34.54 36.07,34.54 v47.37,23.24
  Bottom 0.203: v47.37,23.24 47.37,18.03 49.28,16.13
  Bottom 0.254: 49.28,16.13 71.88,16.13 GPIO_EXTRA.5
P5.6  (via drill 0.38)
  Top 0.254: LEVEL_TRANSLATOR_3.2 27.94,55.63 27.3,54.99 v27.3,53.21 | v24.26,50.16 20.57,50.16 v20.32,49.91 | v21.21,25.65 22.61,25.65 MSP432P401R.70
  Bottom 0.254: v27.3,53.21 v24.26,50.16 | v20.32,49.91 17.78,47.37 17.78,42.16 14.1,38.48 14.1,32.77 v21.21,25.65
P5.6_5V  (via drill 0.38, 0.5, 0.6)
  Top 0.254: v35.56,58.8 44.96,58.8 v46.1,57.66 | v46.74,43.18 v66.55,43.18
  Top 0.305: LEVEL_TRANSLATOR_3.13 v27.94,61.98 | v67.31,37.72 67.82,37.21 ULTRA5.3
  Bottom 0.254: v46.1,57.66 46.1,43.81 v46.74,43.18 | v66.55,43.18 67.18,42.55 67.18,37.85 v67.31,37.72
  Bottom 0.305: v27.94,61.98 31.11,58.8 v35.56,58.8
P5.7  (via drill 0.38)  (1 unrouted)
  Top 0.203: MSP432P401R.71 22.4,24.77 v20.83,24.77
  Top 0.254: LEVEL_TRANSLATOR_3.3 29.21,54.86 v28.7,54.36 | v9.91,53.47 24.13,53.47 v24.38,53.72 | 6.1,49.66 4.83,48.39 4.83,34.92 5.59,34.16 5.59,28.19 6.35,27.43 11.68,27.43 v14.35,30.1
  Bottom 0.254: v28.7,54.36 25.02,54.36 v24.38,53.72 | v6.35,49.91 v9.91,53.47 | v14.35,30.1 15.49,30.1 v20.83,24.77
P5.7_5V  (via drill 0.38, 0.6)
  Top 0.305: LEVEL_TRANSLATOR_3.12 v29.21,62.36 | v38.48,59.82 49.15,59.82 49.78,60.45 v49.78,60.58 | v49.78,64.26 50.29,64.77 74.04,64.77 v75.56,63.25
  Bottom 0.305: v29.21,62.36 31.75,59.82 v38.48,59.82 | v49.78,60.58 v49.78,64.26 | ULTRA5.2 74.42,39.75 75.56,40.89 v75.56,63.25
P6.6  (via drill 0.38)
  Top 0.254: LEVEL_TRANSLATOR_3.4 30.48,58.67 | v45.72,22.1 33.6,22.1 MSP432P401R.80
  Top 0.305: 30.48,58.67 30.48,58.8 31.75,60.07 34.67,60.07 36.07,61.47 41.4,61.47 v41.78,61.09
  Bottom 0.305: v41.78,61.09 41.78,42.8 43.18,41.4 45.09,41.4 46.35,40.13 46.35,22.73 v45.72,22.1
P6.6_5V  (via drill 0.38)
  Top 0.305: 30.48,63.37 LEVEL_TRANSLATOR_3.11 30.48,61.59 29.84,60.96 22.48,60.96 v21.21,59.69 | v20.57,47.24 v15.24,47.24 | v14.22,42.67 12.57,41.02 ULTRA6.3
  Bottom 0.305: v15.24,47.24 14.22,46.23 v14.22,42.67 | v21.21,59.69 21.21,47.88 v20.57,47.24
P6.7  (via drill 0.38)
  Top 0.254: MSP432P401R.81 33.52,22.86 42.16,22.86 v43.2,23.9 | LEVEL_TRANSLATOR_3.5 31.75,57.91 31.88,57.91 32.77,57.02 39.37,57.02 v39.75,56.64 39.5,56.9
  Bottom 0.254: 43.18,33.91 43.18,37.21 40.77,39.62 40.77,55.63 v39.75,56.64 | 43.18,33.91 43.18,33.4 | v43.2,23.9 43.2,33.88 43.18,33.91
P6.7_5V  (via drill 0.38)
  Top 0.305: ULTRA6.2 v15.49,38.48 | v30.99,65.28 31.37,65.28 31.75,64.9 LEVEL_TRANSLATOR_3.10
  Bottom 0.305: v15.49,38.48 22.1,45.09 22.1,58.29 24.26,60.45 24.26,63.63 24.77,64.13 29.84,64.13 v30.99,65.28
P7.4  (via drill 0.38)
  Top 0.203: MSP432P401R.26 arc45 25.5,44.35 24.77,45.09 24.77,45.34 v25.27,45.85 | v34.29,54.74 v42.93,54.74 | v44.07,63.37 55.5,63.37 v55.88,63.75
  Bottom 0.203: v25.27,45.85 25.4,45.85 v34.29,54.74 | 43.81,62.99 43.81,63.12 v44.07,63.37
  Bottom 0.254: NAZE32_PINHEAD.6 v55.88,63.75 | 43.81,62.99 43.81,55.63 v42.93,54.74
P7.5  (via drill 0.38)
  Top 0.203: MSP432P401R.27 arc-45 25.1,43.99 24.26,44.83 24.26,45.85 v25.65,47.24 | v32.38,53.85 v52.07,53.85
  Bottom 0.203: NAZE32_PINHEAD.5 53.34,54.99 52.26,53.91 arc-45 52.11,53.85 v52.07,53.85 | v25.65,47.24 v32.38,53.85
P7.6  (via drill 0.38)
  Top 0.203: MSP432P401R.28 23.75,44.67 23.75,46.48 v24.13,46.86 | v30.35,53.09 v49.4,53.09
  Bottom 0.203: v24.13,46.86 v30.35,53.09 | v49.4,53.09 50.04,53.09 50.8,54.23
  Bottom 0.254: NAZE32_PINHEAD.4 50.8,54.23
P7.7  (via drill 0.38, 0.5)  (1 unrouted)
  Top 0.203: MSP432P401R.29 23.24,44.46 23.24,47.24 v23.75,47.75 | v31.24,55.37 33.78,55.37 33.91,55.5 35.31,55.5 35.43,55.37 42.55,55.37 42.93,55.75 46.99,55.75 v47.12,55.63
  Bottom 0.203: v23.75,47.75 v31.24,55.37 | v47.12,55.63 47.62,55.63 48.26,56.26
  Bottom 0.254: NAZE32_PINHEAD.3 48.26,56.26
P8.0  (via drill 0.38)
  Top 0.203: 24.1,42.83 MSP432P401R.30 24.77,42.22 24.77,42.16 v26.67,42.16 | LEVEL_TRANSLATOR1.2 58.67,60.07 58.17,59.56 57.78,59.56 v57.66,59.44 | v37.97,50.29 v56.39,50.29
  Bottom 0.203: v56.39,50.29 57.28,51.18 57.28,59.05 v57.66,59.44 | v26.67,42.16 28.19,42.16 36.32,50.29 v37.97,50.29
P8.0_5V  (via drill 0.38)
  Top 0.305: ULTRA1.2 13.59,71.12 18.29,71.12 19.05,70.36 v19.05,70.23 | v20.07,66.67 61.98,66.67 v62.23,66.42 | v62.48,60.07 LEVEL_TRANSLATOR1.13
  Bottom 0.305: v19.05,70.23 19.18,70.1 19.18,66.8 19.3,66.67 v20.07,66.67 | v62.23,66.42 62.23,60.33 v62.48,60.07
P8.1  (via drill 0.38)
  Top 0.203: MSP432P401R.31 25.02,41.27 v27.69,41.27 | LEVEL_TRANSLATOR1.3 59.69,58.8 58.55,57.66 50.93,57.66 v48.01,54.74 | v37.21,44.83 v47.24,44.83
  Bottom 0.203: v48.01,54.74 48.01,45.59 v47.24,44.83 | v37.21,44.83 34.29,44.83 30.73,41.27 v27.69,41.27
P8.1_5V  (via drill 0.38, 0.5)
  Top 0.305: v14.73,73.66 v68.33,73.66 | v69.47,60.2 68.2,58.93 66.3,58.93 LEVEL_TRANSLATOR1.12
  Bottom 0.305: ULTRA1.3 13.97,72.9 v14.73,73.66 | v69.47,60.2 69.47,72.52 v68.33,73.66
P8.2  (via drill 0.38)  (1 unrouted)
  Top 0.203: 18.46,37.29 14.61,41.15 14.61,41.53 v14.73,41.66 | v19.94,51.05 24.77,51.05 26.29,49.53 v51.82,49.53 | v53.72,53.85 57.78,53.85 58.42,54.48
  Top 0.254: 59.69,57.53 58.42,56.26 58.42,54.48
  Top 0.279: LEVEL_TRANSLATOR1.4 59.69,57.53
  Bottom 0.203: v14.73,41.66 16.64,43.56 16.64,47.75 v19.94,51.05 | v53.72,53.85 52.96,53.09 52.96,50.16 52.32,49.53 v51.82,49.53
P8.2_5V
  Top 0.305: LEVEL_TRANSLATOR1.11 69.72,57.53 ULTRA2.2
P9.2  (via drill 0.38)
  Top 0.203: MSP432P401R.74 23.94,24.14 arc45 23.88,24 v23.88,23.5 | v26.92,21.08 v43.31,21.08
  Top 0.254: v58.93,41.02 45.72,41.02 v44.45,39.75 | LEVEL_TRANSLATOR1.5 59.82,56.26 59.31,55.75 v59.31,55.24
  Bottom 0.203: v23.88,23.5 26.23,21.14 arc45 26.37,21.08 v26.92,21.08 | v43.31,21.08 44.39,22.16 arc45 44.45,22.31 44.45,22.35
  Bottom 0.254: v59.31,55.24 59.31,41.27 59.05,41.02 v58.93,41.02
  Bottom 0.305: v44.45,39.75 44.45,22.35
P9.2_5V
  Top 0.305: LEVEL_TRANSLATOR1.10 70.99,56.26 ULTRA2.3
P9.3  (via drill 0.38, 0.5, 0.6)
  Top 0.203: 25.52,25.01 MSP432P401R.75 25.4,24.92
  Top 0.254: v22.23,20.42 22.25,20.42 24.89,23.06 24.89,24.42 MSP432P401R.75
  Top 0.305: v1.78,54.99 1.78,55.5 2.54,56.26 8.89,56.26 10.16,57.53 LEVEL_TRANSLATOR_2.2 | v21.44,16.38 21.16,16.1 21.13,16.1 17.17,12.14 12.29,12.14 10.26,14.17 10.26,16.05 8.03,18.29 4.95,18.29 v1.78,21.46
  Bottom 0.254: v21.44,16.38 21.44,19.63 v22.23,20.42
  Bottom 0.305: v1.78,54.99 v1.78,21.46
P9.3_5V  (via drill 0.7)
  Top 0.305: v5.08,60.07 8.89,60.07 10.16,61.34 LEVEL_TRANSLATOR_2.13
  Bottom 0.305: v5.08,60.07 4.45,60.07 3.05,58.67 3.05,17.65 8.89,11.81 ULTRA3.2
P10.3  (via drill 0.38, 0.6)
  Top 0.254: v39.24,41.15 39.24,40.17 MSP432P401R.3 | v31.62,56.64 32,56.26 v37.97,56.26
  Top 0.305: LEVEL_TRANSLATOR_2.5 13.97,57.28 14.61,56.64 v23.24,56.64
  Bottom 0.254: v23.24,56.64 v31.62,56.64 | v39.24,41.15 39.24,54.99 v37.97,56.26
P10.3_GPIO5V  (via drill 0.38)
  Top 0.254: 28.45,71.12 22.99,71.12 v22.48,70.61
  Top 0.305: LEVEL_TRANSLATOR_2.10 13.97,62.61 15.37,61.21 21.34,61.21 v21.84,61.72 | 28.45,71.12 29.21,70.36 ULTRA4.3
  Bottom 0.305: v22.48,70.61 22.1,70.23 22.1,61.98 v21.84,61.72
P10.4  (via drill 0.38)
  Top 0.203: LEVEL_TRANSLATOR_2.3 11.43,56.26 12.95,54.74 v14.73,54.74 | v16.26,48.64 28.57,48.64 30.23,46.99 30.23,45.97 28.21,43.96 MSP432P401R.24
  Bottom 0.203: v14.73,54.74 14.99,54.74 15.49,54.23 15.49,49.4 v16.26,48.64
P10.4_5V  (via drill 0.7)
  Top 0.305: v11.43,61.34 LEVEL_TRANSLATOR_2.12
  Bottom 0.305: ULTRA3.3 v11.43,61.34
P10.5  (via drill 0.38)
  Top 0.203: MSP432P401R.25 27.79,44.3 v26.8,43.31
  Top 0.305: LEVEL_TRANSLATOR_2.4 12.7,57.28 14.48,55.5 22.23,55.5 v22.86,54.86
  Bottom 0.203: v26.8,43.31 23.5,43.31 22.86,43.94 v22.86,54.86
P10.5_5V  (via drill 0.5)
  Top 0.254: v13.84,65.66 16.76,65.66 17.91,64.52 v23.5,64.52
  Top 0.305: v13.84,65.66 13.21,65.66 12.7,65.15 LEVEL_TRANSLATOR_2.11
  Bottom 0.254: v23.5,64.52 24.77,65.79 29.84,65.79 31.75,67.69
  Bottom 0.305: ULTRA4.2 31.75,67.69
VBAT_TX  (via drill 0.5)
  Top 0.254: U$3.5 53.65,26.44 53.65,27.13 53.98,27.46 v63.3,27.46
  Bottom 0.254: 64.54,28.7 v63.3,27.46
  Bottom 0.305: BATTERY_FC_PINS.1 68.83,49.91 67.18,48.26 67.18,45.09 64.54,42.44 64.54,28.7
VCORE  (via drill 0.38)
  Top 0.203: MSP432P401R.12 31.88,39.16 31.88,39.12 31.62,38.86 31.62,38.23 v31.88,37.97
  Bottom 0.203: 40.55,33.83 L1.1 40.31,33.4 36.83,33.4 36.16,34.07 C11.1 | 31.88,36.26 CPOLARIZED.1 31.88,36.9 v31.88,37.97
  Bottom 0.254: C11.1 33.69,34.25 CPOLARIZED.1
VSW  (via drill 0.5)
  Top 0.203: MSP432P401R.14 31.7,40.46 33.15,41.91 34.16,41.91 35.81,40.26 35.81,38.86 v36.07,38.61
  Bottom 0.203: L1.2 40.59,35.56 39.12,35.56 v36.07,38.61

### Text on the board
tPlace: GND | 5VDC | GND | ECE477 Team 9 | Archit Aggarwal | Shubham Agrawal | Sheik Dawood | D-3MQ | Akash Kumar | RESET SWITCH | rev 3.0
tNames: Trig | GND | GND | Echo | Trig | 5VDC | 5VDC | Echo | 5VDC | Trig | Echo | GND | VBAT_TX | 3V3 | 5VDC | GND | Echo | Trig | Trig | Echo | 5VDC | GND | LDO Regulator | GND | P4.0 | VIN | P4.1 | P4.5 | P4.6 | P4.7 | Echo | Trig | GND | TX | RX | 5VDC